# Altium project InterfaceA.PrjPcb
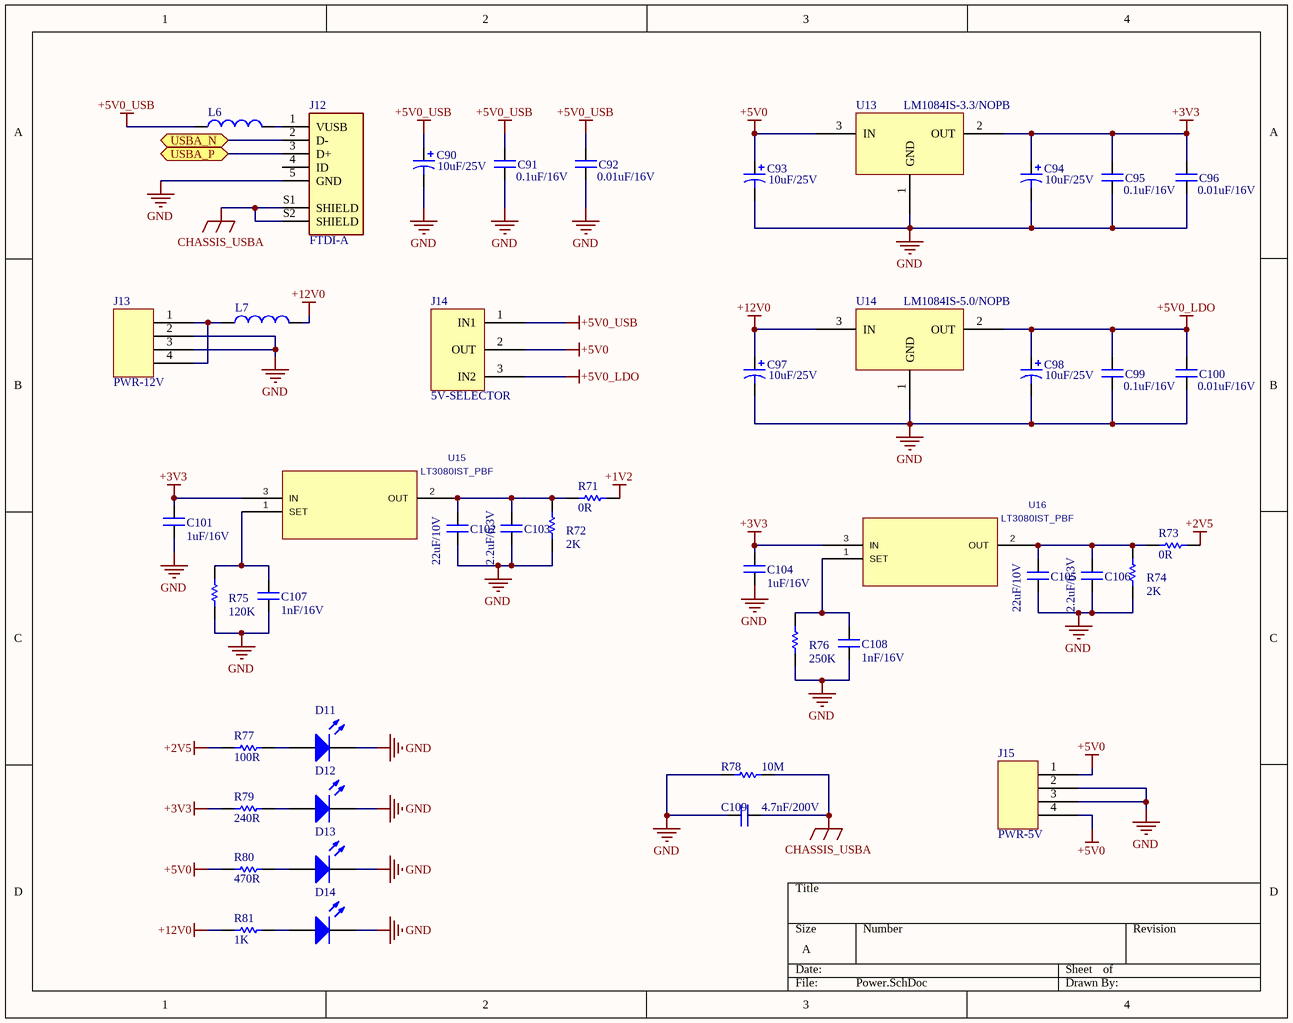
[diagram p0: Power.SchDoc]
9 sheets, 256 parts. Net scope: flat (ports and power ports of the same name join across sheets).
Board file: PCB1.PcbDoc
Sheets:
  Power.SchDoc
  InterfacesA_FPGA.SchDoc
  InterfacesA_Decoupling.SchDoc
  InterfacesA_RGMII_Ethernet.SchDoc
  InterfacesA_SWITCH_LEDS.SchDoc
  InterfacesA_TRANSCEIVER.SchDoc
  InterfacesA_USBFTDI.SchDoc
  InterfacesA_Xbee_Transceiver.SchDoc
  InterfacesA_CONNECTORS.SchDoc

## Sheet Power.SchDoc
size A; DocumentNumber: 1; SheetNumber: 1

### Parts
C90  value 10uF/25V  [CASE-C]  (hidden comment: CASE-C)
C91  value 0.1uF/16V  [CAP_0805]  (hidden comment: CAP_0805)
C92  value 0.01uF/16V  [CAP_0805]  (hidden comment: CAP_0805)
C93  value 10uF/25V  [CASE-C]  (hidden comment: CASE-C)
C94  value 10uF/25V  [CASE-C]  (hidden comment: CASE-C)
C95  value 0.1uF/16V  [CAP_0805]  (hidden comment: CAP_0805)
C96  value 0.01uF/16V  [CAP_0805]  (hidden comment: CAP_0805)
C97  value 10uF/25V  [CASE-C]  (hidden comment: CASE-C)
C98  value 10uF/25V  [CASE-C]  (hidden comment: CASE-C)
C99  value 0.1uF/16V  [CAP_0805]  (hidden comment: CAP_0805)
C100  value 0.01uF/16V  [CAP_0805]  (hidden comment: CAP_0805)
C101  value 1uF/16V  [CAP_0805]  (hidden comment: CAP_0805)
C102  value 22uF/10V  [CAP_0805]  (hidden comment: CAP_0805)
C103  value 2.2uF/6.3V  [CAP_0805]  (hidden comment: CAP_0805)
C104  value 1uF/16V  [CAP_0805]  (hidden comment: CAP_0805)
C105  value 22uF/10V  [CAP_0805]  (hidden comment: CAP_0805)
C106  value 2.2uF/6.3V  [CAP_0805]  (hidden comment: CAP_0805)
C107  value 1nF/16V  [CAP_0805]  (hidden comment: CAP_0805)
C108  value 1nF/16V  [CAP_0805]  (hidden comment: CAP_0805)
C109  value 4.7nF/200V  [CAP_0805]  (hidden comment: CAP_0805)
D11  LED_0603  [LED_0603]  (value not drawn)
D12  LED_0603  [LED_0603]  (value not drawn)
D13  LED_0603  [LED_0603]  (value not drawn)
D14  LED_0603  [LED_0603]  (value not drawn)
J12  FTDI-A  [UX60-MB-5S8]
J13  PWR-12V  [HEADER_4]
J14  5V-SELECTOR  [JUMPER 3 PIN]
J15  PWR-5V  [HEADER_4]
L6  IND_0805  [IND_0805]  (value not drawn)
L7  IND_0805  [IND_0805]  (value not drawn)
R71  value 0R  [RES_0805]  (hidden comment: RES_0805)
R72  value 2K  [RES_0805]  (hidden comment: RES_0805)
R73  value 0R  [RES_0805]  (hidden comment: RES_0805)
R74  value 2K  [RES_0805]  (hidden comment: RES_0805)
R75  value 120K  [RES_0805]  (hidden comment: RES_0805)
R76  value 250K  [RES_0805]  (hidden comment: RES_0805)
R77  value 100R  [RES_0805]  (hidden comment: RES_0805)
R78  value 10M  [RES_0805]  (hidden comment: RES_0805)
R79  value 240R  [RES_0805]  (hidden comment: RES_0805)
R80  value 470R  [RES_0805]  (hidden comment: RES_0805)
R81  value 1K  [RES_0805]  (hidden comment: RES_0805)
U13  LM1084IS-3.3/NOPB  [LM1084IS-3.3/NOPB]
U14  LM1084IS-5.0/NOPB  [LM1084IS-5.0/NOPB]
U15  LT3080IST_PBF  [LT3080IST_PBF]
U16  LT3080IST_PBF  [LT3080IST_PBF]

### Ports
USBA_N (bidir), USBA_P (bidir)

### Nets
+1V2: R71.1
+2V5: R73.1 R77.1
+3V3: C94.A C95.2 C96.2 C101.2 C104.2 R79.1 U13.2(OUT) U15.3(IN) U16.3(IN)
+5V0: C93.A J14.2(OUT) J15.1 J15.4 R80.1 U13.3(IN)
+5V0_LDO: C98.A C99.2 C100.2 J14.3(IN2) U14.2(OUT)
+5V0_USB: C90.A C91.2 C92.2 J14.1(IN1) L6.1
+12V0: C97.A L7.2 R81.1 U14.3(IN)
CHASSIS_USBA: C109.1 J12.S1(SHIELD) J12.S2(SHIELD) R78.1
GND: C90.K C91.1 C92.1 C93.K C94.K C95.1 C96.1 C97.K C98.K C99.1 C100.1 C101.1 C102.1 C103.1 C104.1 C105.1 C106.1 C107.1 C108.1 C109.2 D11.2(K) D12.2(K) D13.2(K) D14.2(K) J12.5(GND) J13.2 J13.3 J15.2 J15.3 R72.1 R74.1 R75.1 R76.1 R78.2 U13.1(GND) U14.1(GND)
USBA_N: J12.2(D-) ; port USBA_N
USBA_P: J12.3(D+) ; port USBA_P
NetC102_2: C102.2 C103.2 R71.2 R72.2 U15.2(OUT)
NetC105_2: C105.2 C106.2 R73.2 R74.2 U16.2(OUT)
NetC107_2: C107.2 R75.2 U15.1(SET)
NetC108_2: C108.2 R76.2 U16.1(SET)
NetD11_1: D11.1(A) R77.2
NetD12_1: D12.1(A) R79.2
NetD13_1: D13.1(A) R80.2
NetD14_1: D14.1(A) R81.2
NetJ12_1: J12.1(VUSB) L6.2
NetJ13_1: J13.1 J13.4 L7.1

Not connected (* = marked no-connect by the designer): J12 4(ID)

### Library data of the parts
J12 = UX60-MB-5S8: USB MINI TYPE B
J13 J15 = HEADER_4
J14 = JUMPER 3 PIN
U15 U16 = LT3080IST_PBF: Manufacturer_Part_Number: LT3080IST#PBF; Vendor: Linear Technology; SourceLibrary: LinearTech_2016-05-13_3; Built_By: EMA_UL_Team; Value: LT3080IST_PBF
U13 = LM1084IS-3.3/NOPB: Supplier 1: Digi-Key; Supplier Part Number 1: 296-35390-1-ND
U14 = LM1084IS-5.0/NOPB: Supplier 1: Digi-Key; Supplier Part Number 1: 296-35390-1-ND

## Sheet InterfacesA_FPGA.SchDoc
size A; DocumentNumber: 2; SheetNumber: 2
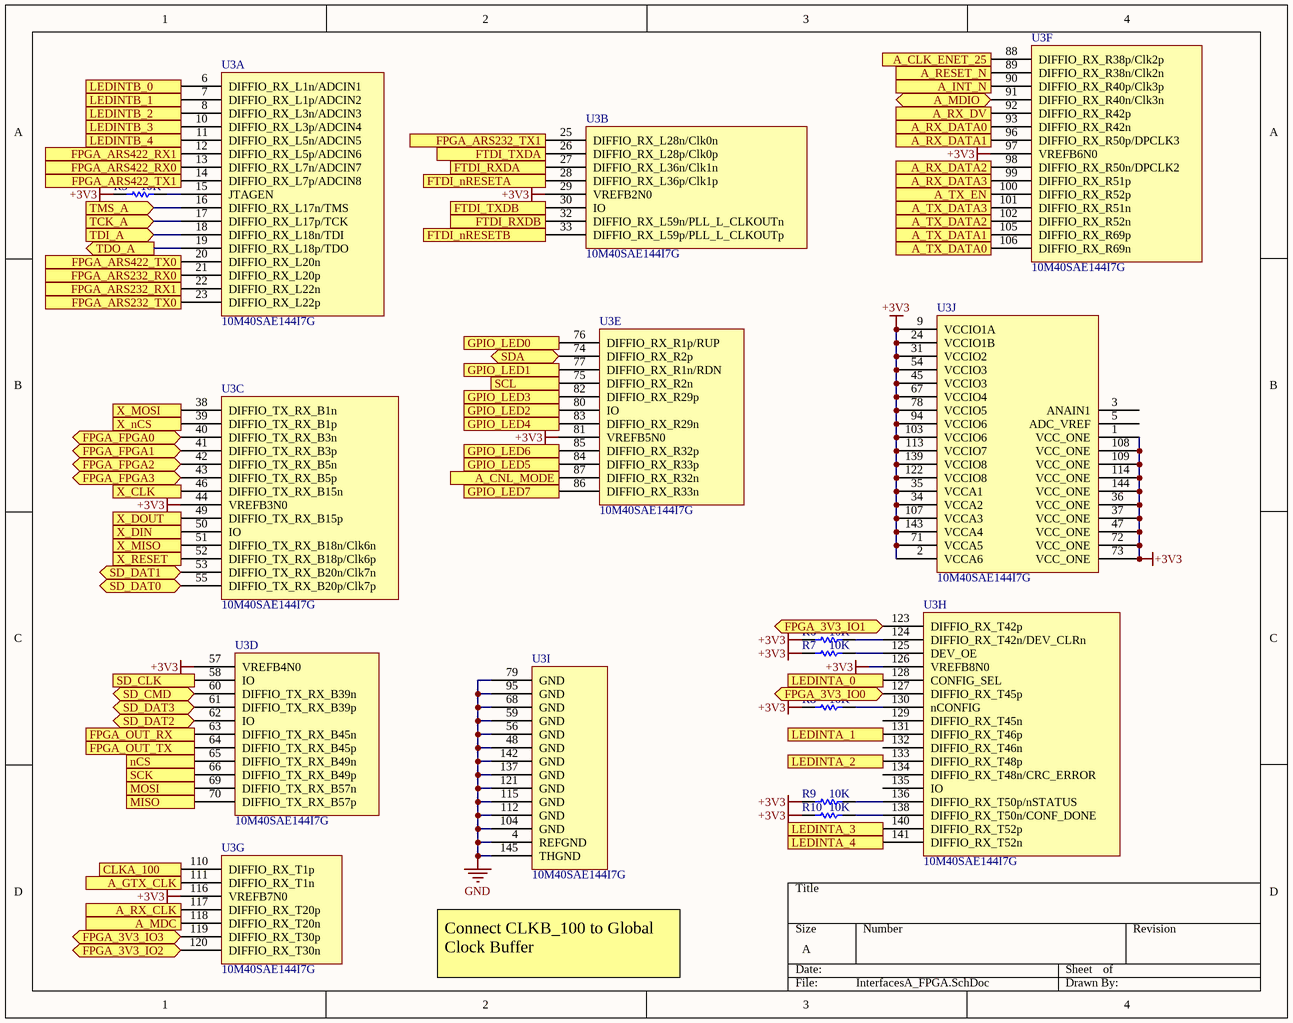
[diagram p1: InterfacesA_FPGA.SchDoc]

### Parts
R5  value 10K  [RES_0805]  (hidden comment: RES_0805)
R6  value 10K  [RES_0805]  (hidden comment: RES_0805)
R7  value 10K  [RES_0805]  (hidden comment: RES_0805)
R8  value 10K  [RES_0805]  (hidden comment: RES_0805)
R9  value 10K  [RES_0805]  (hidden comment: RES_0805)
R10  value 10K  [RES_0805]  (hidden comment: RES_0805)
U3  10M40SAE144I7G  [10M40SAE144I7G]  (parts A,B,C,D,E,F,G,H,I,J of 10)

### Ports
A_CLK_ENET_25 (out), A_CNL_MODE (in), A_GTX_CLK (out), A_INT_N (in), A_MDC (out), A_MDIO (bidir), A_RESET_N (out), A_RX_CLK (out), A_RX_DATA0 (in), A_RX_DATA1 (in), A_RX_DATA2 (in), A_RX_DATA3 (in), A_RX_DV (in), A_TX_DATA0 (out), A_TX_DATA1 (out), A_TX_DATA2 (out), A_TX_DATA3 (out), A_TX_EN (out), CLKA_100 (out), FPGA_3V3_IO0 (bidir), FPGA_3V3_IO1 (bidir), FPGA_3V3_IO2 (bidir), FPGA_3V3_IO3 (bidir), FPGA_ARS232_RX0 (in), FPGA_ARS232_RX1 (in), FPGA_ARS232_TX0 (out), FPGA_ARS232_TX1 (out), FPGA_ARS422_RX0 (in), FPGA_ARS422_RX1 (in), FPGA_ARS422_TX0 (out), FPGA_ARS422_TX1 (out), FPGA_FPGA0 (bidir), FPGA_FPGA1 (bidir), FPGA_FPGA2 (bidir), FPGA_FPGA3 (bidir), FPGA_OUT_RX (in), FPGA_OUT_TX (out), FTDI_nRESETA (out), FTDI_nRESETB (out), FTDI_RXDA (in), FTDI_RXDB (in), FTDI_TXDA (out), FTDI_TXDB (out), GPIO_LED0 (out), GPIO_LED1 (out), GPIO_LED2 (out), GPIO_LED3 (out), GPIO_LED4 (out), GPIO_LED5 (out), GPIO_LED6 (out), GPIO_LED7 (out), LEDINTA_0 (out), LEDINTA_1 (out), LEDINTA_2 (out), LEDINTA_3 (out), LEDINTA_4 (out), LEDINTB_0 (out), LEDINTB_1 (out), LEDINTB_2 (out), LEDINTB_3 (out), LEDINTB_4 (out), MISO (in), MOSI (out), nCS (out), SCK (out), SCL (out), SD_CLK (out), SD_CMD (bidir), SD_DAT0 (bidir), SD_DAT1 (bidir), SD_DAT2 (bidir), SD_DAT3 (bidir), SDA (bidir), TCK_A (in), TDI_A (in), TDO_A (out), TMS_A (in), X_CLK (out), X_DIN (out), X_DOUT (in), X_MISO (in), X_MOSI (out), X_nCS (out), X_RESET (out)

### Nets
+3V3: R5.2 R6.2 R7.2 R8.2 R9.2 R10.2 U3.1(VCC_ONE) U3.2(VCCA6) U3.9(VCCIO1A) U3.24(VCCIO1B) U3.29(VREFB2N0) U3.31(VCCIO2) U3.34(VCCA2) U3.35(VCCA1) U3.36(VCC_ONE) U3.37(VCC_ONE) U3.44(VREFB3N0) U3.45(VCCIO3) U3.47(VCC_ONE) U3.54(VCCIO3) U3.57(VREFB4N0) U3.67(VCCIO4) U3.71(VCCA5) U3.72(VCC_ONE) U3.73(VCC_ONE) U3.78(VCCIO5) U3.81(VREFB5N0) U3.94(VCCIO6) U3.97(VREFB6N0) U3.103(VCCIO6) U3.107(VCCA3) U3.108(VCC_ONE) U3.109(VCC_ONE) U3.113(VCCIO7) U3.114(VCC_ONE) U3.116(VREFB7N0) U3.122(VCCIO8) U3.126(VREFB8N0) U3.139(VCCIO8) U3.143(VCCA4) U3.144(VCC_ONE)
GND: U3.4(REFGND) U3.48(GND) U3.56(GND) U3.59(GND) U3.68(GND) U3.79(GND) U3.95(GND) U3.104(GND) U3.112(GND) U3.115(GND) U3.121(GND) U3.137(GND) U3.142(GND) U3.145(THGND)
CLK: U3.58(IO) ; port SD_CLK
CLK_ENET_25: U3.88(DIFFIO_RX_R38p/Clk2p) ; port A_CLK_ENET_25
CLKA_100: U3.110(DIFFIO_RX_T1p) ; port CLKA_100
CMD: U3.60(DIFFIO_TX_RX_B39n) ; port SD_CMD
CNL_MODE: U3.87(DIFFIO_RX_R32n) ; port A_CNL_MODE
DAT0: U3.55(DIFFIO_TX_RX_B20p/Clk7p) ; port SD_DAT0
DAT1: U3.53(DIFFIO_TX_RX_B20n/Clk7n) ; port SD_DAT1
DAT2: U3.62(IO) ; port SD_DAT2
DAT3: U3.61(DIFFIO_TX_RX_B39p) ; port SD_DAT3
FPGA_3V3_IO0: U3.127(DIFFIO_RX_T45p) ; port FPGA_3V3_IO0
FPGA_3V3_IO1: U3.123(DIFFIO_RX_T42p) ; port FPGA_3V3_IO1
FPGA_3V3_IO2: U3.120(DIFFIO_RX_T30n) ; port FPGA_3V3_IO2
FPGA_3V3_IO3: U3.119(DIFFIO_RX_T30p) ; port FPGA_3V3_IO3
FPGA_ARS232_RX0: U3.21(DIFFIO_RX_L20p) ; port FPGA_ARS232_RX0
FPGA_ARS232_RX1: U3.22(DIFFIO_RX_L22n) ; port FPGA_ARS232_RX1
FPGA_ARS232_TX0: U3.23(DIFFIO_RX_L22p) ; port FPGA_ARS232_TX0
FPGA_ARS232_TX1: U3.25(DIFFIO_RX_L28n/Clk0n) ; port FPGA_ARS232_TX1
FPGA_ARS422_RX0: U3.13(DIFFIO_RX_L7n/ADCIN7) ; port FPGA_ARS422_RX0
FPGA_ARS422_RX1: U3.12(DIFFIO_RX_L5p/ADCIN6) ; port FPGA_ARS422_RX1
FPGA_ARS422_TX0: U3.20(DIFFIO_RX_L20n) ; port FPGA_ARS422_TX0
FPGA_ARS422_TX1: U3.14(DIFFIO_RX_L7p/ADCIN8) ; port FPGA_ARS422_TX1
FPGA_FPGA0: U3.40(DIFFIO_TX_RX_B3n) ; port FPGA_FPGA0
FPGA_FPGA1: U3.41(DIFFIO_TX_RX_B3p) ; port FPGA_FPGA1
FPGA_FPGA2: U3.42(DIFFIO_TX_RX_B5n) ; port FPGA_FPGA2
FPGA_FPGA3: U3.43(DIFFIO_TX_RX_B5p) ; port FPGA_FPGA3
FPGA_OUT_RX: U3.63(DIFFIO_TX_RX_B45n) ; port FPGA_OUT_RX
FPGA_OUT_TX: U3.64(DIFFIO_TX_RX_B45p) ; port FPGA_OUT_TX
FTDI_RXDA: U3.27(DIFFIO_RX_L36n/Clk1n) ; port FTDI_RXDA
FTDI_RXDB: U3.32(DIFFIO_RX_L59n/PLL_L_CLKOUTn) ; port FTDI_RXDB
FTDI_TXDA: U3.26(DIFFIO_RX_L28p/Clk0p) ; port FTDI_TXDA
FTDI_TXDB: U3.30(IO) ; port FTDI_TXDB
GPIO_LED0: U3.76(DIFFIO_RX_R1p/RUP) ; port GPIO_LED0
GPIO_LED1: U3.77(DIFFIO_RX_R1n/RDN) ; port GPIO_LED1
GPIO_LED2: U3.80(IO) ; port GPIO_LED2
GPIO_LED3: U3.82(DIFFIO_RX_R29p) ; port GPIO_LED3
GPIO_LED4: U3.83(DIFFIO_RX_R29n) ; port GPIO_LED4
GPIO_LED5: U3.84(DIFFIO_RX_R33p) ; port GPIO_LED5
GPIO_LED6: U3.85(DIFFIO_RX_R32p) ; port GPIO_LED6
GPIO_LED7: U3.86(DIFFIO_RX_R33n) ; port GPIO_LED7
GTX_CLK: U3.111(DIFFIO_RX_T1n) ; port A_GTX_CLK
INT_N: U3.90(DIFFIO_RX_R40p/Clk3p) ; port A_INT_N
LEDINTA_0: U3.128(CONFIG_SEL) ; port LEDINTA_0
LEDINTA_1: U3.131(DIFFIO_RX_T46p) ; port LEDINTA_1
LEDINTA_2: U3.133(DIFFIO_RX_T48p) ; port LEDINTA_2
LEDINTA_3: U3.140(DIFFIO_RX_T52p) ; port LEDINTA_3
LEDINTA_4: U3.141(DIFFIO_RX_T52n) ; port LEDINTA_4
LEDINTB_0: U3.6(DIFFIO_RX_L1n/ADCIN1) ; port LEDINTB_0
LEDINTB_1: U3.7(DIFFIO_RX_L1p/ADCIN2) ; port LEDINTB_1
LEDINTB_2: U3.8(DIFFIO_RX_L3n/ADCIN3) ; port LEDINTB_2
LEDINTB_3: U3.10(DIFFIO_RX_L3p/ADCIN4) ; port LEDINTB_3
LEDINTB_4: U3.11(DIFFIO_RX_L5n/ADCIN5) ; port LEDINTB_4
MDC: U3.118(DIFFIO_RX_T20n) ; port A_MDC
MDIO: U3.91(DIFFIO_RX_R40n/Clk3n) ; port A_MDIO
MISO: U3.70(DIFFIO_TX_RX_B57p) ; port MISO
MOSI: U3.69(DIFFIO_TX_RX_B57n) ; port MOSI
nCS: U3.65(DIFFIO_TX_RX_B49n) ; port nCS
nRST: U3.52(DIFFIO_TX_RX_B18p/Clk6p) ; port X_RESET
RESET_N: U3.89(DIFFIO_RX_R38n/Clk2n) ; port A_RESET_N
RST_A: U3.28(DIFFIO_RX_L36p/Clk1p) ; port FTDI_nRESETA
RST_B: U3.33(DIFFIO_RX_L59p/PLL_L_CLKOUTp) ; port FTDI_nRESETB
RX_CLK: U3.117(DIFFIO_RX_T20p) ; port A_RX_CLK
RX_DATA0: U3.93(DIFFIO_RX_R42n) ; port A_RX_DATA0
RX_DATA1: U3.96(DIFFIO_RX_R50p/DPCLK3) ; port A_RX_DATA1
RX_DATA2: U3.98(DIFFIO_RX_R50n/DPCLK2) ; port A_RX_DATA2
RX_DATA3: U3.99(DIFFIO_RX_R51p) ; port A_RX_DATA3
RX_DV: U3.92(DIFFIO_RX_R42p) ; port A_RX_DV
SCK: U3.66(DIFFIO_TX_RX_B49p) ; port SCK
SCL: U3.75(DIFFIO_RX_R2n) ; port SCL
SDA: U3.74(DIFFIO_RX_R2p) ; port SDA
TCK_A: U3.17(DIFFIO_RX_L17p/TCK) ; port TCK_A
TDI_A: U3.18(DIFFIO_RX_L18n/TDI) ; port TDI_A
TDO_A: U3.19(DIFFIO_RX_L18p/TDO) ; port TDO_A
TMS_A: U3.16(DIFFIO_RX_L17n/TMS) ; port TMS_A
TX_DATA0: U3.106(DIFFIO_RX_R69n) ; port A_TX_DATA0
TX_DATA1: U3.105(DIFFIO_RX_R69p) ; port A_TX_DATA1
TX_DATA2: U3.102(DIFFIO_RX_R52n) ; port A_TX_DATA2
TX_DATA3: U3.101(DIFFIO_RX_R51n) ; port A_TX_DATA3
TX_EN: U3.100(DIFFIO_RX_R52p) ; port A_TX_EN
X_CLK: U3.46(DIFFIO_TX_RX_B15n) ; port X_CLK
X_DIN: U3.50(IO) ; port X_DIN
X_DOUT: U3.49(DIFFIO_TX_RX_B15p) ; port X_DOUT
X_MISO: U3.51(DIFFIO_TX_RX_B18n/Clk6n) ; port X_MISO
X_MOSI: U3.38(DIFFIO_TX_RX_B1n) ; port X_MOSI
X_nCS: U3.39(DIFFIO_TX_RX_B1p) ; port X_nCS
NetR5_1: R5.1 U3.15(JTAGEN)
NetR6_1: R6.1 U3.124(DIFFIO_RX_T42n/DEV_CLRn)
NetR7_1: R7.1 U3.125(DEV_OE)
NetR8_1: R8.1 U3.130(nCONFIG)
NetR9_1: R9.1 U3.136(DIFFIO_RX_T50p/nSTATUS)
NetR10_1: R10.1 U3.138(DIFFIO_RX_T50n/CONF_DONE)

Not connected (* = marked no-connect by the designer): U3 3(ANAIN1) 5(ADC_VREF) 129(DIFFIO_RX_T45n) 132(DIFFIO_RX_T46n) 134(DIFFIO_RX_T48n/CRC_ERROR) 135(IO)

### Notes on the sheet
- Connect CLKB_100 to Global Clock Buffer

### Library data of the parts
U3 = 10M40SAE144I7G: IC FPGA 101 I/O 144EQFP

## Sheet InterfacesA_Decoupling.SchDoc
size A; DocumentNumber: 3; SheetNumber: 3
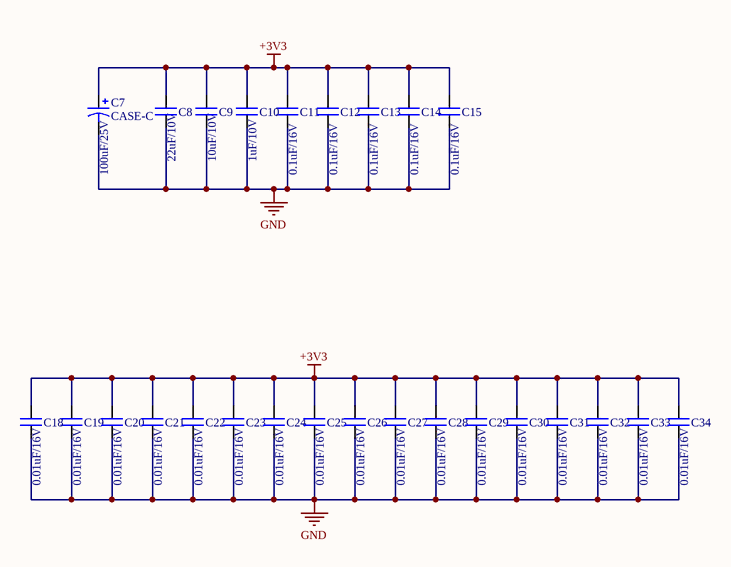
[diagram p2: InterfacesA_Decoupling.SchDoc]

### Parts
C7  CASE-C  value 100uF/25V  [CASE-C]
C8  value 22uF/10V  [CAP_0805]  (hidden comment: CAP_0805)
C9  value 10uF/10V  [CAP_0805]  (hidden comment: CAP_0805)
C10  value 1uF/10V  [CAP_0805]  (hidden comment: CAP_0805)
C11  value 0.1uF/16V  [CAP_0805]  (hidden comment: CAP_0805)
C12  value 0.1uF/16V  [CAP_0805]  (hidden comment: CAP_0805)
C13  value 0.1uF/16V  [CAP_0805]  (hidden comment: CAP_0805)
C14  value 0.1uF/16V  [CAP_0805]  (hidden comment: CAP_0805)
C15  value 0.1uF/16V  [CAP_0805]  (hidden comment: CAP_0805)
C18  value 0.01uF/16V  [CAP_0805]  (hidden comment: CAP_0805)
C19  value 0.01uF/16V  [CAP_0805]  (hidden comment: CAP_0805)
C20  value 0.01uF/16V  [CAP_0805]  (hidden comment: CAP_0805)
C21  value 0.01uF/16V  [CAP_0805]  (hidden comment: CAP_0805)
C22  value 0.01uF/16V  [CAP_0805]  (hidden comment: CAP_0805)
C23  value 0.01uF/16V  [CAP_0805]  (hidden comment: CAP_0805)
C24  value 0.01uF/16V  [CAP_0805]  (hidden comment: CAP_0805)
C25  value 0.01uF/16V  [CAP_0805]  (hidden comment: CAP_0805)
C26  value 0.01uF/16V  [CAP_0805]  (hidden comment: CAP_0805)
C27  value 0.01uF/16V  [CAP_0805]  (hidden comment: CAP_0805)
C28  value 0.01uF/16V  [CAP_0805]  (hidden comment: CAP_0805)
C29  value 0.01uF/16V  [CAP_0805]  (hidden comment: CAP_0805)
C30  value 0.01uF/16V  [CAP_0805]  (hidden comment: CAP_0805)
C31  value 0.01uF/16V  [CAP_0805]  (hidden comment: CAP_0805)
C32  value 0.01uF/16V  [CAP_0805]  (hidden comment: CAP_0805)
C33  value 0.01uF/16V  [CAP_0805]  (hidden comment: CAP_0805)
C34  value 0.01uF/16V  [CAP_0805]  (hidden comment: CAP_0805)

### Nets
+3V3: C7.A C8.2 C9.2 C10.2 C11.2 C12.2 C13.2 C14.2 C15.2 C18.2 C19.2 C20.2 C21.2 C22.2 C23.2 C24.2 C25.2 C26.2 C27.2 C28.2 C29.2 C30.2 C31.2 C32.2 C33.2 C34.2
GND: C7.K C8.1 C9.1 C10.1 C11.1 C12.1 C13.1 C14.1 C15.1 C18.1 C19.1 C20.1 C21.1 C22.1 C23.1 C24.1 C25.1 C26.1 C27.1 C28.1 C29.1 C30.1 C31.1 C32.1 C33.1 C34.1

## Sheet InterfacesA_RGMII_Ethernet.SchDoc
size A4; DocumentNumber: 8; SheetNumber: 8
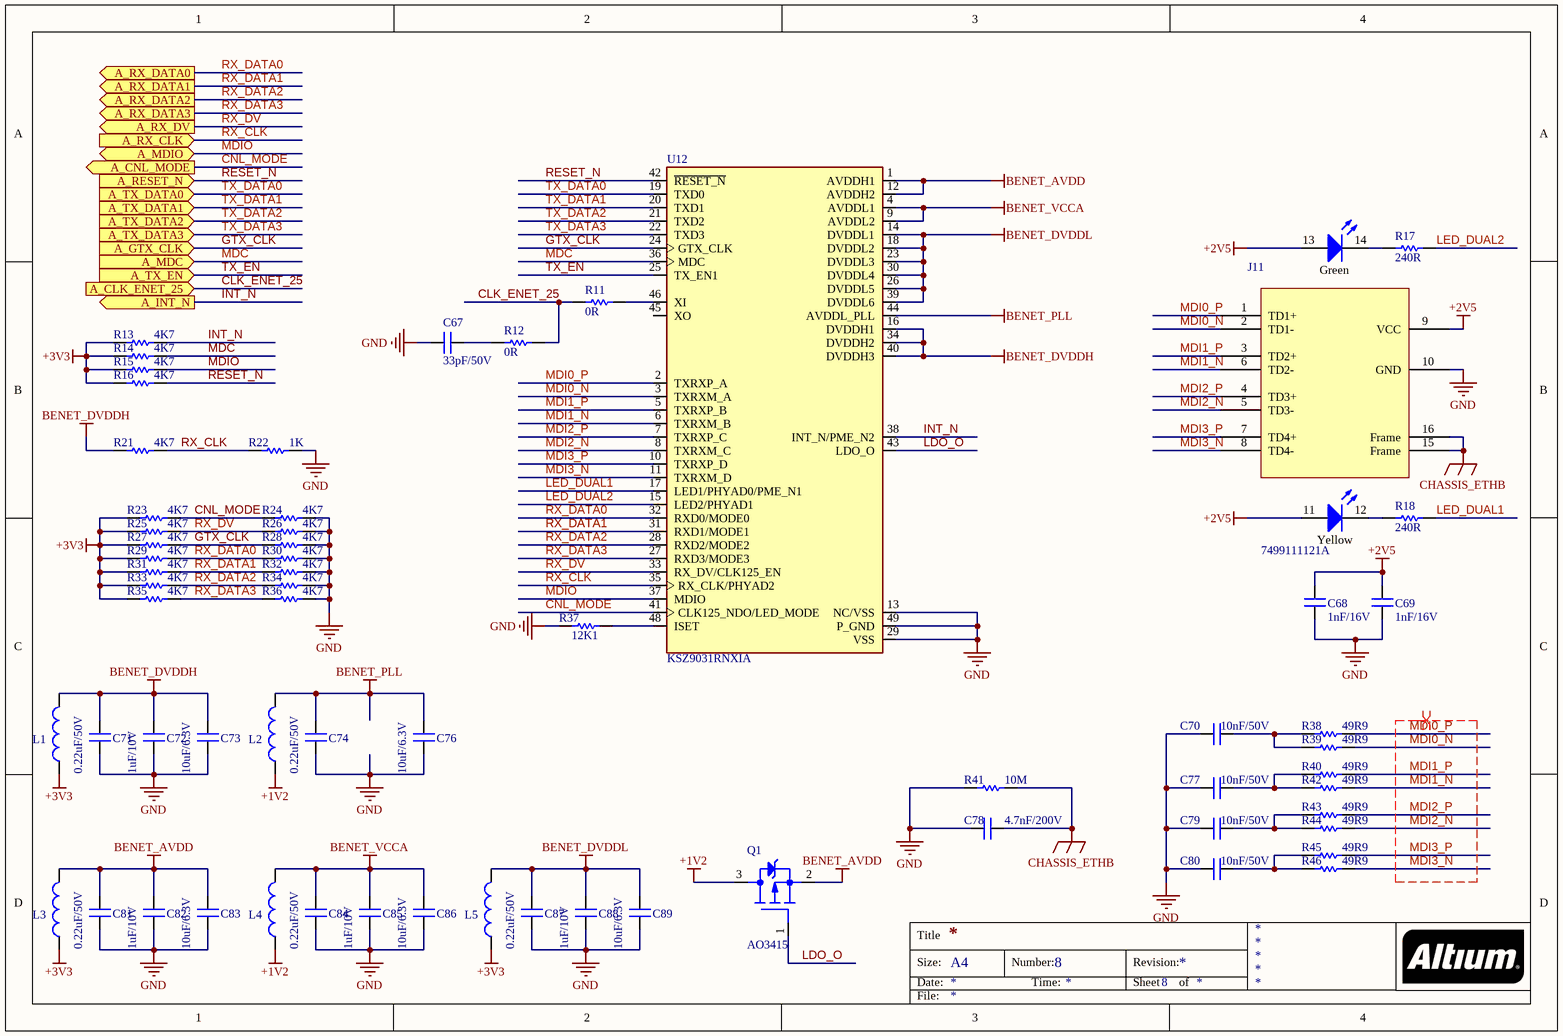
[diagram p3: InterfacesA_RGMII_Ethernet.SchDoc]

### Parts
C67  value 33pF/50V  [CAP_0805]  (hidden comment: CAP_0805)
C68  value 1nF/16V  [CAP_0805]  (hidden comment: CAP_0805)
C69  value 1nF/16V  [CAP_0805]  (hidden comment: CAP_0805)
C70  value 10nF/50V  [CAP_0805]  (hidden comment: CAP_0805)
C71  value 0.22uF/50V  [CAP_0805]  (hidden comment: CAP_0805)
C72  value 1uF/10V  [CAP_0805]  (hidden comment: CAP_0805)
C73  value 10uF/6.3V  [CAP_0805]  (hidden comment: CAP_0805)
C74  value 0.22uF/50V  [CAP_0805]  (hidden comment: CAP_0805)
C76  value 10uF/6.3V  [CAP_0805]  (hidden comment: CAP_0805)
C77  value 10nF/50V  [CAP_0805]  (hidden comment: CAP_0805)
C78  value 4.7nF/200V  [CAP_0805]  (hidden comment: CAP_0805)
C79  value 10nF/50V  [CAP_0805]  (hidden comment: CAP_0805)
C80  value 10nF/50V  [CAP_0805]  (hidden comment: CAP_0805)
C81  value 0.22uF/50V  [CAP_0805]  (hidden comment: CAP_0805)
C82  value 1uF/10V  [CAP_0805]  (hidden comment: CAP_0805)
C83  value 10uF/6.3V  [CAP_0805]  (hidden comment: CAP_0805)
C84  value 0.22uF/50V  [CAP_0805]  (hidden comment: CAP_0805)
C85  value 1uF/10V  [CAP_0805]  (hidden comment: CAP_0805)
C86  value 10uF/6.3V  [CAP_0805]  (hidden comment: CAP_0805)
C87  value 0.22uF/50V  [CAP_0805]  (hidden comment: CAP_0805)
C88  value 1uF/10V  [CAP_0805]  (hidden comment: CAP_0805)
C89  value 10uF/6.3V  [CAP_0805]  (hidden comment: CAP_0805)
J11  7499111121A  [7499111121A]
L1  IND_0805  [IND_0805]  (value not drawn)
L2  IND_0805  [IND_0805]  (value not drawn)
L3  IND_0805  [IND_0805]  (value not drawn)
L4  IND_0805  [IND_0805]  (value not drawn)
L5  IND_0805  [IND_0805]  (value not drawn)
Q1  AO3415  [AO3415]
R11  value 0R  [RES_0805]  (hidden comment: RES_0805)
R12  value 0R  [RES_0805]  (hidden comment: RES_0805)
R13  value 4K7  [RES_0805]  (hidden comment: RES_0805)
R14  value 4K7  [RES_0805]  (hidden comment: RES_0805)
R15  value 4K7  [RES_0805]  (hidden comment: RES_0805)
R16  value 4K7  [RES_0805]  (hidden comment: RES_0805)
R17  value 240R  [RES_0805]  (hidden comment: RES_0805)
R18  value 240R  [RES_0805]  (hidden comment: RES_0805)
R21  value 4K7  [RES_0805]  (hidden comment: RES_0805)
R22  value 1K  [RES_0805]  (hidden comment: RES_0805)
R23  value 4K7  [RES_0805]  (hidden comment: RES_0805)
R24  value 4K7  [RES_0805]  (hidden comment: RES_0805)
R25  value 4K7  [RES_0805]  (hidden comment: RES_0805)
R26  value 4K7  [RES_0805]  (hidden comment: RES_0805)
R27  value 4K7  [RES_0805]  (hidden comment: RES_0805)
R28  value 4K7  [RES_0805]  (hidden comment: RES_0805)
R29  value 4K7  [RES_0805]  (hidden comment: RES_0805)
R30  value 4K7  [RES_0805]  (hidden comment: RES_0805)
R31  value 4K7  [RES_0805]  (hidden comment: RES_0805)
R32  value 4K7  [RES_0805]  (hidden comment: RES_0805)
R33  value 4K7  [RES_0805]  (hidden comment: RES_0805)
R34  value 4K7  [RES_0805]  (hidden comment: RES_0805)
R35  value 4K7  [RES_0805]  (hidden comment: RES_0805)
R36  value 4K7  [RES_0805]  (hidden comment: RES_0805)
R37  value 12K1  [RES_0805]  (hidden comment: RES_0805)
R38  value 49R9  [RES_0805]  (hidden comment: RES_0805)
R39  value 49R9  [RES_0805]  (hidden comment: RES_0805)
R40  value 49R9  [RES_0805]  (hidden comment: RES_0805)
R41  value 10M  [RES_0805]  (hidden comment: RES_0805)
R42  value 49R9  [RES_0805]  (hidden comment: RES_0805)
R43  value 49R9  [RES_0805]  (hidden comment: RES_0805)
R44  value 49R9  [RES_0805]  (hidden comment: RES_0805)
R45  value 49R9  [RES_0805]  (hidden comment: RES_0805)
R46  value 49R9  [RES_0805]  (hidden comment: RES_0805)
U12  KSZ9031RNXIA  [KSZ9031RNXIA]

### Ports
A_CLK_ENET_25 (in), A_CNL_MODE (out), A_GTX_CLK (in), A_INT_N (out), A_MDC (in), A_MDIO (bidir), A_RESET_N (in), A_RX_CLK (in), A_RX_DATA0 (out), A_RX_DATA1 (out), A_RX_DATA2 (out), A_RX_DATA3 (out), A_RX_DV (out), A_TX_DATA0 (in), A_TX_DATA1 (in), A_TX_DATA2 (in), A_TX_DATA3 (in), A_TX_EN (in)

### Nets
+1V2: L2.1 L4.1 Q1.3(D)
+2V5: C68.2 C69.2 J11.9(VCC) J11.11(A) J11.13(A)
+3V3: L1.1 L3.1 L5.1 R13.2 R14.2 R15.2 R16.2 R23.2 R25.2 R27.2 R29.2 R31.2 R33.2 R35.2
BENET_AVDD: C81.2 C82.2 C83.2 L3.2 Q1.2(S) U12.1(AVDDH1) U12.12(AVDDH2)
BENET_DVDDH: C71.2 C72.2 C73.2 L1.2 R21.2 U12.16(DVDDH1) U12.34(DVDDH2) U12.40(DVDDH3)
BENET_DVDDL: C87.2 C88.2 C89.2 L5.2 U12.14(DVDDL1) U12.18(DVDDL2) U12.23(DVDDL3) U12.26(DVDDL5) U12.30(DVDDL4) U12.39(DVDDL6)
BENET_PLL: C74.2 C76.2 L2.2 U12.44(AVDDL_PLL)
BENET_VCCA: C84.2 C85.2 C86.2 L4.2 U12.4(AVDDL1) U12.9(AVDDL2)
CHASSIS_ETHB: C78.1 J11.15(Frame) J11.16(Frame) R41.1
GND: C67.2 C68.1 C69.1 C70.2 C71.1 C72.1 C73.1 C74.1 C76.1 C77.2 C78.2 C79.2 C80.2 C81.1 C82.1 C83.1 C84.1 C85.1 C86.1 C87.1 C88.1 C89.1 J11.10(GND) R22.1 R24.1 R26.1 R28.1 R30.1 R32.1 R34.1 R36.1 R37.1 R41.2 U12.13(NC/VSS) U12.29(VSS) U12.49(P_GND)
CLK_ENET_25: R11.2 R12.2 ; port A_CLK_ENET_25
CNL_MODE: R23.1 R24.2 U12.41(CLK125_NDO/LED_MODE) ; port A_CNL_MODE
GTX_CLK: R27.1 R28.2 U12.24(GTX_CLK) ; port A_GTX_CLK
INT_N: R13.1 U12.38(INT_N/PME_N2) ; port A_INT_N
LDO_O: Q1.1(G) U12.43(LDO_O)
LED_DUAL1: R18.2 U12.17(LED1/PHYAD0/PME_N1)
LED_DUAL2: R17.2 U12.15(LED2/PHYAD1)
MDC: R14.1 U12.36(MDC) ; port A_MDC
MDI0_N: J11.2(TD1-) R39.2 U12.3(TXRXM_A)
MDI0_P: J11.1(TD1+) R38.2 U12.2(TXRXP_A)
MDI1_N: J11.6(TD2-) R42.2 U12.6(TXRXM_B)
MDI1_P: J11.3(TD2+) R40.2 U12.5(TXRXP_B)
MDI2_N: J11.5(TD3-) R44.2 U12.8(TXRXM_C)
MDI2_P: J11.4(TD3+) R43.2 U12.7(TXRXP_C)
MDI3_N: J11.8(TD4-) R46.2 U12.11(TXRXM_D)
MDI3_P: J11.7(TD4+) R45.2 U12.10(TXRXP_D)
MDIO: R15.1 U12.37(MDIO) ; port A_MDIO
RESET_N: R16.1 U12.42(~{RESET_N}) ; port A_RESET_N
RX_CLK: R21.1 R22.2 U12.35(RX_CLK/PHYAD2) ; port A_RX_CLK
RX_DATA0: R29.1 R30.2 U12.32(RXD0/MODE0) ; port A_RX_DATA0
RX_DATA1: R31.1 R32.2 U12.31(RXD1/MODE1) ; port A_RX_DATA1
RX_DATA2: R33.1 R34.2 U12.28(RXD2/MODE2) ; port A_RX_DATA2
RX_DATA3: R35.1 R36.2 U12.27(RXD3/MODE3) ; port A_RX_DATA3
RX_DV: R25.1 R26.2 U12.33(RX_DV/CLK125_EN) ; port A_RX_DV
TX_DATA0: U12.19(TXD0) ; port A_TX_DATA0
TX_DATA1: U12.20(TXD1) ; port A_TX_DATA1
TX_DATA2: U12.21(TXD2) ; port A_TX_DATA2
TX_DATA3: U12.22(TXD3) ; port A_TX_DATA3
TX_EN: U12.25(TX_EN1) ; port A_TX_EN
NetC67_1: C67.1 R12.1
NetC70_1: C70.1 R38.1 R39.1
NetC77_1: C77.1 R40.1 R42.1
NetC79_1: C79.1 R43.1 R44.1
NetC80_1: C80.1 R45.1 R46.1
NetJ11_12: J11.12(K) R18.1
NetJ11_14: J11.14(K) R17.1
NetR11_1: R11.1 U12.46(XI)
NetR37_2: R37.2 U12.48(ISET)

Not connected (* = marked no-connect by the designer): U12 45(XO)

### Layout directives
differential pair: MDI0_N, MDI0_P, MDI1_N, MDI1_P, MDI2_N, MDI2_P, MDI3_N, MDI3_P

### Notes on the sheet
- Title
- Size:
- Date:
- A4
- Number:
- Time:
- Revision:
- Sheet
- of
- File:
- (in symbol 7499111121A) Green; Yellow

### Library data of the parts
Q1 = AO3415: 20V P-Channel MOSFET
U12 = KSZ9031RNXIA: 4/4 Transceiver Full Ethernet 48-QFN _7x7_; MF: Microchip; MP: KSZ9031RNXIA; Digi-Key_Purchase_URL: https://www.digikey.pk/product-detail/en/microchip-technology/KSZ9031RNXIA-TR/KSZ9031RNXIA-TR-ND/3925129?utm_source=snapeda&utm_medium=aggregator&utm_campaign=symbol; Package: QFN-48 Microchip; SnapEDA_Link: https://www.snapeda.com/parts/KSZ9031RNXIA/Microchip/view-part/378526/?ref=snap; Value: *; Digi-Key_Part_Number: KSZ9031RNXIA-TR-ND
J11 = 7499111121A: Supplier 1: Digi-Key; Supplier Part Number 1: 1297-1070-5-ND

## Sheet InterfacesA_SWITCH_LEDS.SchDoc
size A
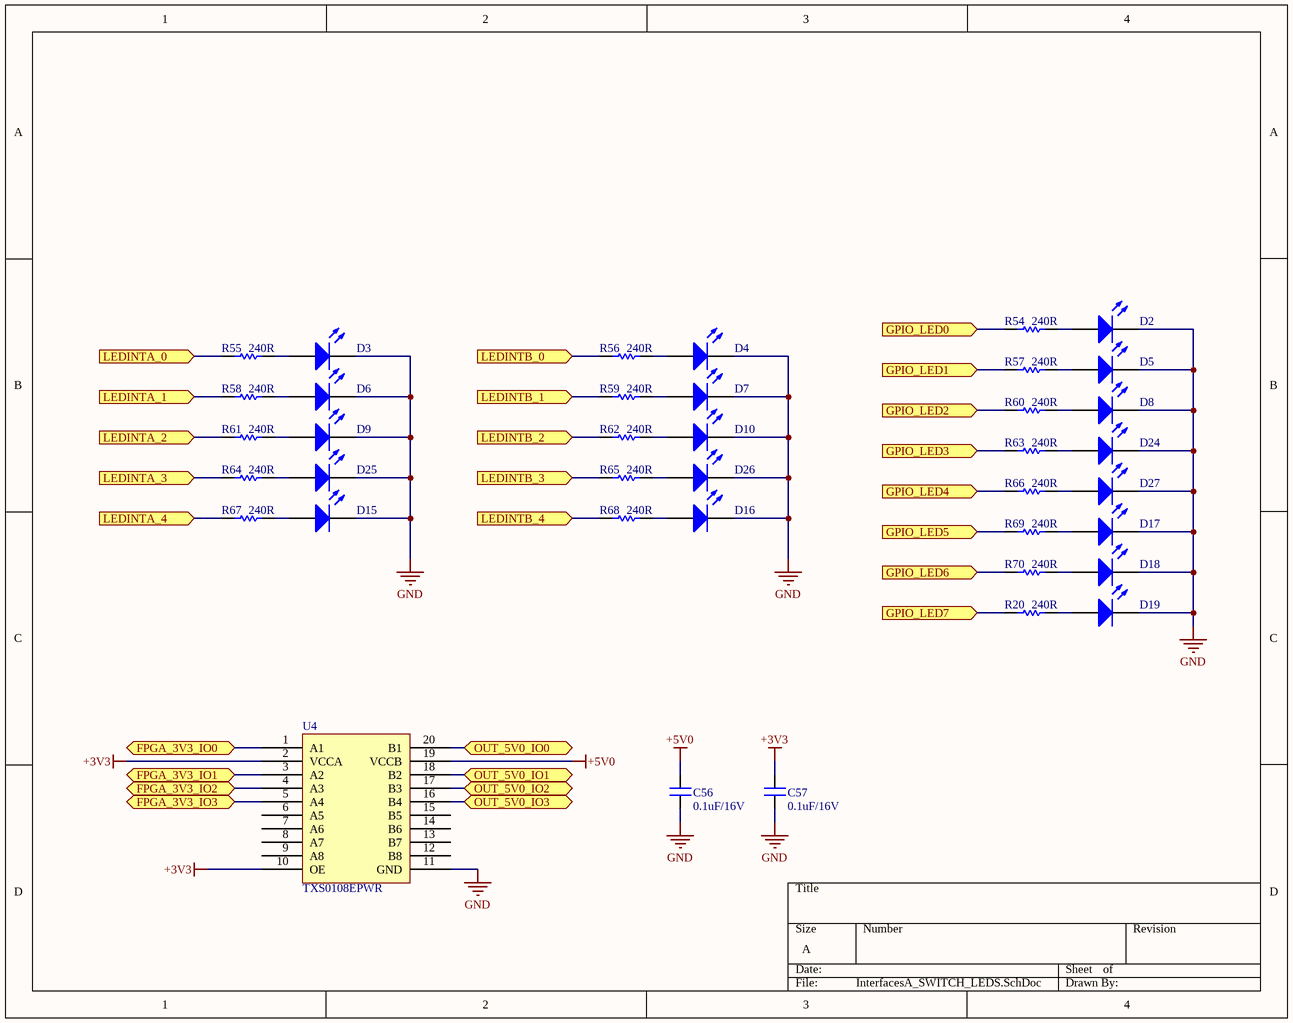
[diagram p4: InterfacesA_SWITCH_LEDS.SchDoc]

### Parts
C56  value 0.1uF/16V  [CAP_0805]  (hidden comment: CAP_0805)
C57  value 0.1uF/16V  [CAP_0805]  (hidden comment: CAP_0805)
D2  LED_0603  [LED_0603]  (value not drawn)
D3  LED_0603  [LED_0603]  (value not drawn)
D4  LED_0603  [LED_0603]  (value not drawn)
D5  LED_0603  [LED_0603]  (value not drawn)
D6  LED_0603  [LED_0603]  (value not drawn)
D7  LED_0603  [LED_0603]  (value not drawn)
D8  LED_0603  [LED_0603]  (value not drawn)
D9  LED_0603  [LED_0603]  (value not drawn)
D10  LED_0603  [LED_0603]  (value not drawn)
D15  LED_0603  [LED_0603]  (value not drawn)
D16  LED_0603  [LED_0603]  (value not drawn)
D17  LED_0603  [LED_0603]  (value not drawn)
D18  LED_0603  [LED_0603]  (value not drawn)
D19  LED_0603  [LED_0603]  (value not drawn)
D24  LED_0603  [LED_0603]  (value not drawn)
D25  LED_0603  [LED_0603]  (value not drawn)
D26  LED_0603  [LED_0603]  (value not drawn)
D27  LED_0603  [LED_0603]  (value not drawn)
R20  value 240R  [RES_0805]  (hidden comment: RES_0805)
R54  value 240R  [RES_0805]  (hidden comment: RES_0805)
R55  value 240R  [RES_0805]  (hidden comment: RES_0805)
R56  value 240R  [RES_0805]  (hidden comment: RES_0805)
R57  value 240R  [RES_0805]  (hidden comment: RES_0805)
R58  value 240R  [RES_0805]  (hidden comment: RES_0805)
R59  value 240R  [RES_0805]  (hidden comment: RES_0805)
R60  value 240R  [RES_0805]  (hidden comment: RES_0805)
R61  value 240R  [RES_0805]  (hidden comment: RES_0805)
R62  value 240R  [RES_0805]  (hidden comment: RES_0805)
R63  value 240R  [RES_0805]  (hidden comment: RES_0805)
R64  value 240R  [RES_0805]  (hidden comment: RES_0805)
R65  value 240R  [RES_0805]  (hidden comment: RES_0805)
R66  value 240R  [RES_0805]  (hidden comment: RES_0805)
R67  value 240R  [RES_0805]  (hidden comment: RES_0805)
R68  value 240R  [RES_0805]  (hidden comment: RES_0805)
R69  value 240R  [RES_0805]  (hidden comment: RES_0805)
R70  value 240R  [RES_0805]  (hidden comment: RES_0805)
U4  TXS0108EPWR  [TXS0108EPWR]

### Ports
FPGA_3V3_IO0 (bidir), FPGA_3V3_IO1 (bidir), FPGA_3V3_IO2 (bidir), FPGA_3V3_IO3 (bidir), GPIO_LED0 (in), GPIO_LED1 (in), GPIO_LED2 (in), GPIO_LED3 (in), GPIO_LED4 (in), GPIO_LED5 (in), GPIO_LED6 (in), GPIO_LED7 (in), LEDINTA_0 (in), LEDINTA_1 (in), LEDINTA_2 (in), LEDINTA_3 (in), LEDINTA_4 (in), LEDINTB_0 (in), LEDINTB_1 (in), LEDINTB_2 (in), LEDINTB_3 (in), LEDINTB_4 (in), OUT_5V0_IO0 (bidir), OUT_5V0_IO1 (bidir), OUT_5V0_IO2 (bidir), OUT_5V0_IO3 (bidir)

### Nets
+3V3: C57.2 U4.2(VCCA) U4.10(OE)
+5V0: C56.2 U4.19(VCCB)
GND: C56.1 C57.1 D2.2(K) D3.2(K) D4.2(K) D5.2(K) D6.2(K) D7.2(K) D8.2(K) D9.2(K) D10.2(K) D15.2(K) D16.2(K) D17.2(K) D18.2(K) D19.2(K) D24.2(K) D25.2(K) D26.2(K) D27.2(K) U4.11(GND)
FPGA_3V3_IO0: U4.1(A1) ; port FPGA_3V3_IO0
FPGA_3V3_IO1: U4.3(A2) ; port FPGA_3V3_IO1
FPGA_3V3_IO2: U4.4(A3) ; port FPGA_3V3_IO2
FPGA_3V3_IO3: U4.5(A4) ; port FPGA_3V3_IO3
GPIO_LED0: R54.2 ; port GPIO_LED0
GPIO_LED1: R57.2 ; port GPIO_LED1
GPIO_LED2: R60.2 ; port GPIO_LED2
GPIO_LED3: R63.2 ; port GPIO_LED3
GPIO_LED4: R66.2 ; port GPIO_LED4
GPIO_LED5: R69.2 ; port GPIO_LED5
GPIO_LED6: R70.2 ; port GPIO_LED6
GPIO_LED7: R20.2 ; port GPIO_LED7
LEDINTA_0: R55.2 ; port LEDINTA_0
LEDINTA_1: R58.2 ; port LEDINTA_1
LEDINTA_2: R61.2 ; port LEDINTA_2
LEDINTA_3: R64.2 ; port LEDINTA_3
LEDINTA_4: R67.2 ; port LEDINTA_4
LEDINTB_0: R56.2 ; port LEDINTB_0
LEDINTB_1: R59.2 ; port LEDINTB_1
LEDINTB_2: R62.2 ; port LEDINTB_2
LEDINTB_3: R65.2 ; port LEDINTB_3
LEDINTB_4: R68.2 ; port LEDINTB_4
OUT_5V0_IO0: U4.20(B1) ; port OUT_5V0_IO0
OUT_5V0_IO1: U4.18(B2) ; port OUT_5V0_IO1
OUT_5V0_IO2: U4.17(B3) ; port OUT_5V0_IO2
OUT_5V0_IO3: U4.16(B4) ; port OUT_5V0_IO3
NetD2_1: D2.1(A) R54.1
NetD3_1: D3.1(A) R55.1
NetD4_1: D4.1(A) R56.1
NetD5_1: D5.1(A) R57.1
NetD6_1: D6.1(A) R58.1
NetD7_1: D7.1(A) R59.1
NetD8_1: D8.1(A) R60.1
NetD9_1: D9.1(A) R61.1
NetD10_1: D10.1(A) R62.1
NetD15_1: D15.1(A) R67.1
NetD16_1: D16.1(A) R68.1
NetD17_1: D17.1(A) R69.1
NetD18_1: D18.1(A) R70.1
NetD19_1: D19.1(A) R20.1
NetD24_1: D24.1(A) R63.1
NetD25_1: D25.1(A) R64.1
NetD26_1: D26.1(A) R65.1
NetD27_1: D27.1(A) R66.1

Not connected (* = marked no-connect by the designer): U4 6(A5) 7(A6) 8(A7) 9(A8) 12(B8) 13(B7) 14(B6) 15(B5)

### Library data of the parts
U4 = TXS0108EPWR: Supplier 1: Digi-Key; Supplier Part Number 1: 296-21527-1-ND

## Sheet InterfacesA_TRANSCEIVER.SchDoc
size A
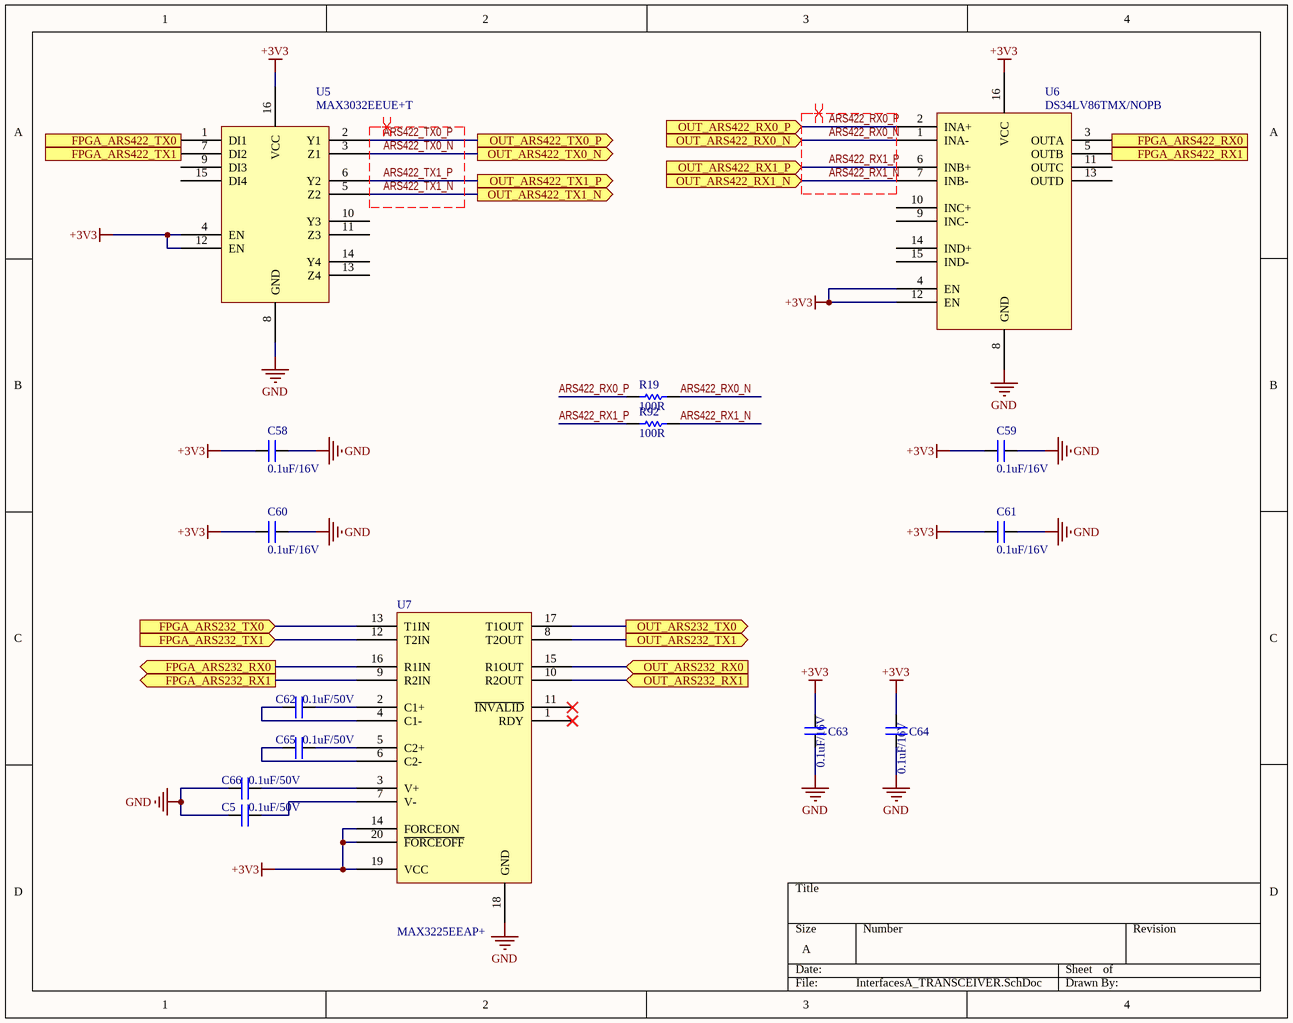
[diagram p5: InterfacesA_TRANSCEIVER.SchDoc]

### Parts
C5  value 0.1uF/50V  [CAP_0805]  (hidden comment: CAP_0805)
C58  value 0.1uF/16V  [CAP_0805]  (hidden comment: CAP_0805)
C59  value 0.1uF/16V  [CAP_0805]  (hidden comment: CAP_0805)
C60  value 0.1uF/16V  [CAP_0805]  (hidden comment: CAP_0805)
C61  value 0.1uF/16V  [CAP_0805]  (hidden comment: CAP_0805)
C62  value 0.1uF/50V  [CAP_0805]  (hidden comment: CAP_0805)
C63  value 0.1uF/16V  [CAP_0805]  (hidden comment: CAP_0805)
C64  value 0.1uF/16V  [CAP_0805]  (hidden comment: CAP_0805)
C65  value 0.1uF/50V  [CAP_0805]  (hidden comment: CAP_0805)
C66  value 0.1uF/50V  [CAP_0805]  (hidden comment: CAP_0805)
R19  value 100R  [RES_0805]  (hidden comment: RES_0805)
R92  value 100R  [RES_0805]  (hidden comment: RES_0805)
U5  MAX3032EEUE+T  [MAX3032EEUE+T]
U6  DS34LV86TMX/NOPB  [DS34LV86TMX/NOPB]
U7  MAX3225EEAP+  [MAX3225EEAP+]

### Ports
FPGA_ARS232_RX0 (out), FPGA_ARS232_RX1 (out), FPGA_ARS232_TX0 (in), FPGA_ARS232_TX1 (in), FPGA_ARS422_RX0 (out), FPGA_ARS422_RX1 (out), FPGA_ARS422_TX0 (in), FPGA_ARS422_TX1 (in), OUT_ARS232_RX0 (in), OUT_ARS232_RX1 (in), OUT_ARS232_TX0 (out), OUT_ARS232_TX1 (out), OUT_ARS422_RX0_N (in), OUT_ARS422_RX0_P (in), OUT_ARS422_RX1_N (in), OUT_ARS422_RX1_P (in), OUT_ARS422_TX0_N (out), OUT_ARS422_TX0_P (out), OUT_ARS422_TX1_N (out), OUT_ARS422_TX1_P (out)

### Nets
+3V3: C58.2 C59.2 C60.2 C61.2 C63.2 C64.2 U5.4(EN) U5.12(EN) U5.16(VCC) U6.4(EN) U6.12(EN) U6.16(VCC) U7.14(FORCEON) U7.19(VCC) U7.20(~{FORCEOFF})
GND: C5.2 C58.1 C59.1 C60.1 C61.1 C63.1 C64.1 C66.2 U5.8(GND) U6.8(GND) U7.18(GND)
ARS422_RX0_N: R19.1 U6.1(INA-) ; port OUT_ARS422_RX0_N
ARS422_RX0_P: R19.2 U6.2(INA+) ; port OUT_ARS422_RX0_P
ARS422_RX1_N: R92.1 U6.7(INB-) ; port OUT_ARS422_RX1_N
ARS422_RX1_P: R92.2 U6.6(INB+) ; port OUT_ARS422_RX1_P
ARS422_TX0_N: U5.3(Z1) ; port OUT_ARS422_TX0_N
ARS422_TX0_P: U5.2(Y1) ; port OUT_ARS422_TX0_P
ARS422_TX1_N: U5.5(Z2) ; port OUT_ARS422_TX1_N
ARS422_TX1_P: U5.6(Y2) ; port OUT_ARS422_TX1_P
FPGA_ARS232_RX0: U7.16(R1IN) ; port FPGA_ARS232_RX0
FPGA_ARS232_RX1: U7.9(R2IN) ; port FPGA_ARS232_RX1
FPGA_ARS232_TX0: U7.13(T1IN) ; port FPGA_ARS232_TX0
FPGA_ARS232_TX1: U7.12(T2IN) ; port FPGA_ARS232_TX1
FPGA_ARS422_RX0: U6.3(OUTA) ; port FPGA_ARS422_RX0
FPGA_ARS422_RX1: U6.5(OUTB) ; port FPGA_ARS422_RX1
FPGA_ARS422_TX0: U5.1(DI1) ; port FPGA_ARS422_TX0
FPGA_ARS422_TX1: U5.7(DI2) ; port FPGA_ARS422_TX1
OUT_ARS232_RX0: U7.15(R1OUT) ; port OUT_ARS232_RX0
OUT_ARS232_RX1: U7.10(R2OUT) ; port OUT_ARS232_RX1
OUT_ARS232_TX0: U7.17(T1OUT) ; port OUT_ARS232_TX0
OUT_ARS232_TX1: U7.8(T2OUT) ; port OUT_ARS232_TX1
NetC5_1: C5.1 U7.7(V-)
NetC62_1: C62.1 U7.2(C1+)
NetC62_2: C62.2 U7.4(C1-)
NetC65_1: C65.1 U7.5(C2+)
NetC65_2: C65.2 U7.6(C2-)
NetC66_1: C66.1 U7.3(V+)

Not connected (* = marked no-connect by the designer): U5 9(DI3) 10(Y3) 11(Z3) 13(Z4) 14(Y4) 15(DI4); U6 9(INC-) 10(INC+) 11(OUTC) 13(OUTD) 14(IND+) 15(IND-); U7 1(RDY)* 11(~{INVALID})*

### Layout directives
differential pair: ARS422_RX0_N, ARS422_RX0_P, ARS422_RX1_N, ARS422_RX1_P, ARS422_TX0_N, ARS422_TX0_P, ARS422_TX1_N, ARS422_TX1_P

### Library data of the parts
C5 C58-C66 = CAP_0603
U5 = MAX3032EEUE+T: Supplier 1: Digi-Key; Supplier Part Number 1: 1016-1522-5-ND
U6 = DS34LV86TMX/NOPB: Supplier 1: Digi-Key; Supplier Part Number 1: 296-13065-1-ND
U7 = MAX3225EEAP+: Supplier 1: Digi-Key; Supplier Part Number 1: MAX3225EEAP+-ND

## Sheet InterfacesA_USBFTDI.SchDoc
size A4
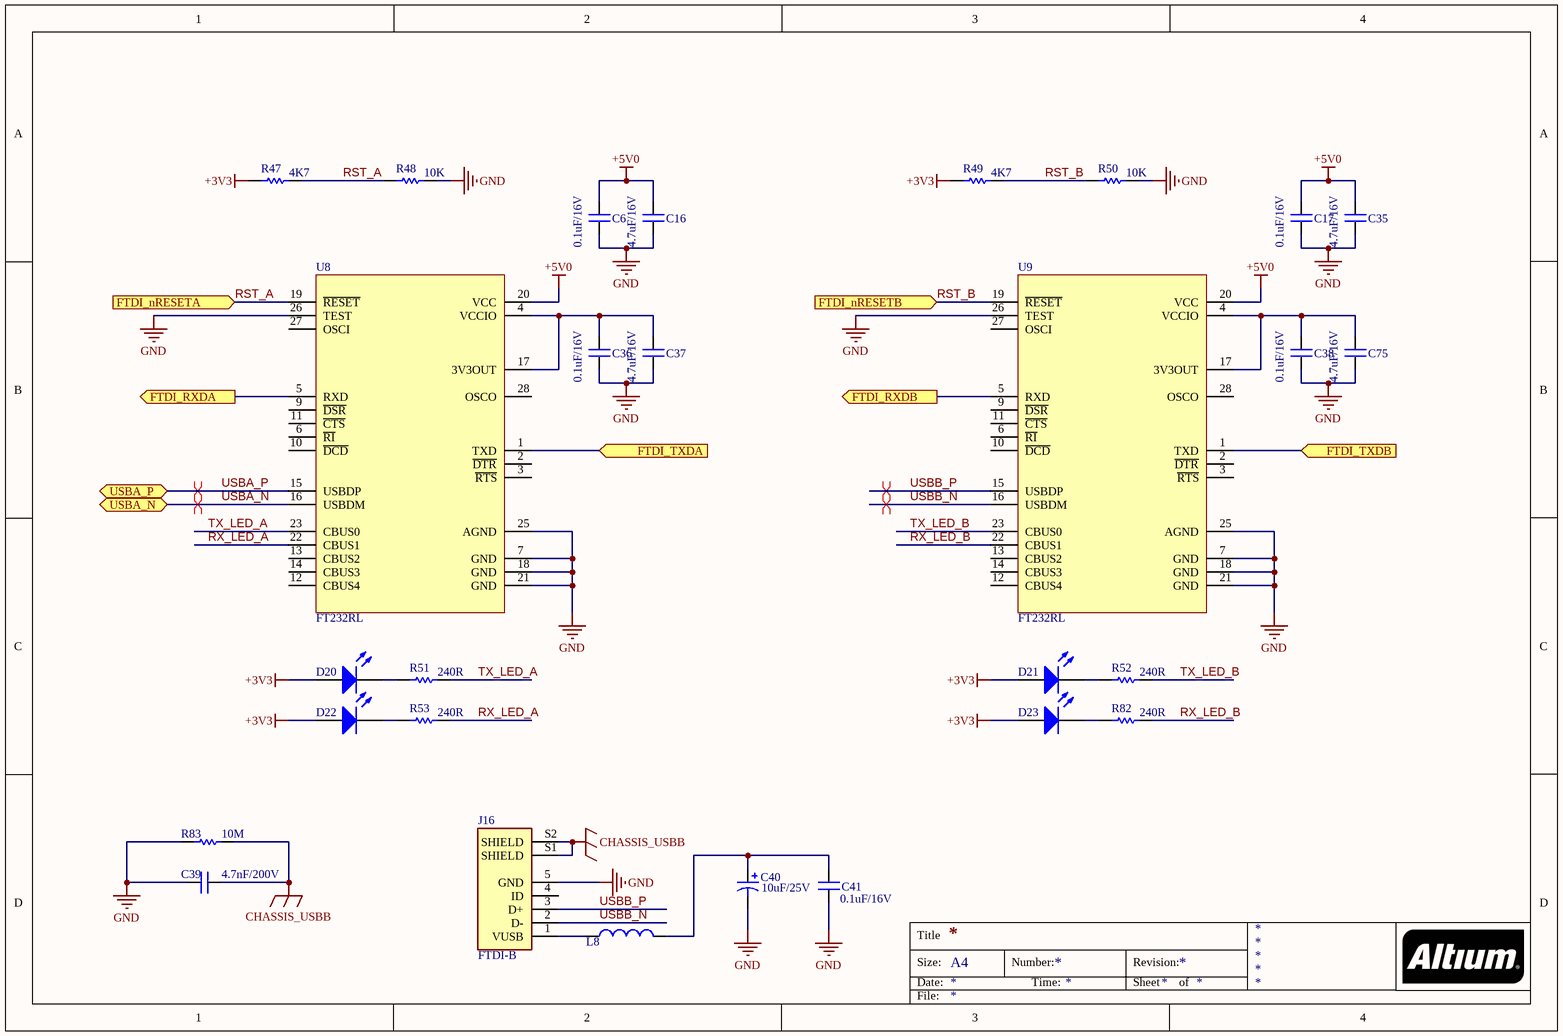
[diagram p6: InterfacesA_USBFTDI.SchDoc]

### Parts
C6  value 0.1uF/16V  [CAP_0805]  (hidden comment: CAP_0805)
C16  value 4.7uF/16V  [CAP_0805]  (hidden comment: CAP_0805)
C17  value 0.1uF/16V  [CAP_0805]  (hidden comment: CAP_0805)
C35  value 4.7uF/16V  [CAP_0805]  (hidden comment: CAP_0805)
C36  value 0.1uF/16V  [CAP_0805]  (hidden comment: CAP_0805)
C37  value 4.7uF/16V  [CAP_0805]  (hidden comment: CAP_0805)
C38  value 0.1uF/16V  [CAP_0805]  (hidden comment: CAP_0805)
C39  value 4.7nF/200V  [CAP_0805]  (hidden comment: CAP_0805)
C40  value 10uF/25V  [CASE-C]  (hidden comment: CASE-C)
C41  value 0.1uF/16V  [CAP_0805]  (hidden comment: CAP_0805)
C75  value 4.7uF/16V  [CAP_0805]  (hidden comment: CAP_0805)
D20  LED_0603  [LED_0603]  (value not drawn)
D21  LED_0603  [LED_0603]  (value not drawn)
D22  LED_0603  [LED_0603]  (value not drawn)
D23  LED_0603  [LED_0603]  (value not drawn)
J16  FTDI-B  [UX60-MB-5S8]
L8  IND_0805  [IND_0805]  (value not drawn)
R47  value 4K7  [RES_0805]  (hidden comment: RES_0805)
R48  value 10K  [RES_0805]  (hidden comment: RES_0805)
R49  value 4K7  [RES_0805]  (hidden comment: RES_0805)
R50  value 10K  [RES_0805]  (hidden comment: RES_0805)
R51  value 240R  [RES_0805]  (hidden comment: RES_0805)
R52  value 240R  [RES_0805]  (hidden comment: RES_0805)
R53  value 240R  [RES_0805]  (hidden comment: RES_0805)
R82  value 240R  [RES_0805]  (hidden comment: RES_0805)
R83  value 10M  [RES_0805]  (hidden comment: RES_0805)
U8  FT232RL  [FT232RL]
U9  FT232RL  [FT232RL]

### Ports
FTDI_nRESETA (in), FTDI_nRESETB (in), FTDI_RXDA (out), FTDI_RXDB (out), FTDI_TXDA (in), FTDI_TXDB (in), USBA_N (bidir), USBA_P (bidir)

### Nets
+3V3: D20.1(A) D21.1(A) D22.1(A) D23.1(A) R47.1 R49.1
+5V0: C6.1 C16.1 C17.1 C35.1 U8.20(VCC) U9.20(VCC)
CHASSIS_USBB: C39.1 J16.S1(SHIELD) J16.S2(SHIELD) R83.1
GND: C6.2 C16.2 C17.2 C35.2 C36.2 C37.2 C38.2 C39.2 C40.K C41.1 C75.2 J16.5(GND) R48.2 R50.2 R83.2 U8.7(GND) U8.18(GND) U8.21(GND) U8.25(AGND) U8.26(TEST) U9.7(GND) U9.18(GND) U9.21(GND) U9.25(AGND) U9.26(TEST)
FTDI_RXDA: U8.5(RXD) ; port FTDI_RXDA
FTDI_RXDB: U9.5(RXD) ; port FTDI_RXDB
FTDI_TXDA: U8.1(TXD) ; port FTDI_TXDA
FTDI_TXDB: U9.1(TXD) ; port FTDI_TXDB
RST_A: R47.2 R48.1 U8.19(~{RESET}) ; port FTDI_nRESETA
RST_B: R49.2 R50.1 U9.19(~{RESET}) ; port FTDI_nRESETB
RX_LED_A: R53.2 U8.22(CBUS1)
RX_LED_B: R82.2 U9.22(CBUS1)
TX_LED_A: R51.2 U8.23(CBUS0)
TX_LED_B: R52.2 U9.23(CBUS0)
USBA_N: U8.16(USBDM) ; port USBA_N
USBA_P: U8.15(USBDP) ; port USBA_P
USBB_N: J16.2(D-) U9.16(USBDM)
USBB_P: J16.3(D+) U9.15(USBDP)
NetC36_1: C36.1 C37.1 U8.4(VCCIO) U8.17(3V3OUT)
NetC38_1: C38.1 C75.1 U9.4(VCCIO) U9.17(3V3OUT)
NetC40_A: C40.A C41.2 L8.2
NetD20_2: D20.2(K) R51.1
NetD21_2: D21.2(K) R52.1
NetD22_2: D22.2(K) R53.1
NetD23_2: D23.2(K) R82.1
NetJ16_1: J16.1(VUSB) L8.1

Not connected (* = marked no-connect by the designer): J16 4(ID); U8 2(~{DTR}) 3(~{RTS}) 6(~{RI}) 9(~{DSR}) 10(~{DCD}) 11(~{CTS}) 12(CBUS4) 13(CBUS2) 14(CBUS3) 27(OSCI) 28(OSCO); U9 2(~{DTR}) 3(~{RTS}) 6(~{RI}) 9(~{DSR}) 10(~{DCD}) 11(~{CTS}) 12(CBUS4) 13(CBUS2) 14(CBUS3) 27(OSCI) 28(OSCO)

### Layout directives
differential pair: USBA_N, USBA_P, USBB_N, USBB_P

### Notes on the sheet
- Title
- Size:
- Date:
- A4
- Number:
- Time:
- Revision:
- Sheet
- of
- File:

### Library data of the parts
C6 C16 C17 C35-C38 C75 = CAP_0603
J16 = UX60-MB-5S8: USB MINI TYPE B
U8 U9 = FT232RL: USB Bridge, USB to UART USB 2.0 UART Interface 28-SSOP; MP: FT232RL-REEL; MF: FTDI,; Digi-Key_Purchase_URL: https://www.digikey.com/product-detail/en/ftdi-future-technology-devices-international-ltd/FT232RL-REEL/768-1007-1-ND/1836402?utm_source=snapeda&utm_medium=aggregator&utm_campaign=symbol; Digi-Key_Part_Number: 768-1007-1-ND; Package: SSOP-28 FTDI; Value: *; SnapEDA_Link: https://www.snapeda.com/parts/FT232RL-REEL/FTDI%2C%20Future%20Technology%20Devices%20International%20Ltd/view-part/45427/?ref=snap

## Sheet InterfacesA_Xbee_Transceiver.SchDoc
size A
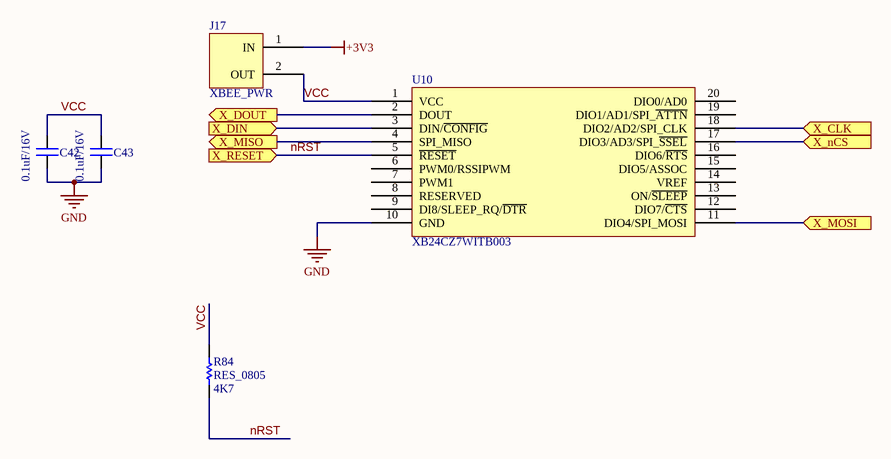
[diagram p7: InterfacesA_Xbee_Transceiver.SchDoc]

### Parts
C42  value 0.1uF/16V  [CAP_0805]  (hidden comment: CAP_0805)
C43  value 0.1uF/16V  [CAP_0805]  (hidden comment: CAP_0805)
J17  XBEE_PWR  [JUMPER 2 PIN]
R84  RES_0805  value 4K7  [RES_0805]
U10  XB24CZ7WITB003  [XB24CZ7WITB003]

### Ports
X_CLK (in), X_DIN (in), X_DOUT (out), X_MISO (out), X_MOSI (in), X_nCS (in), X_RESET (in)

### Nets
+3V3: J17.1(IN)
GND: C42.2 C43.2 U10.10(GND)
nRST: R84.1 U10.5(~{RESET}) ; port X_RESET
VCC: C42.1 C43.1 J17.2(OUT) R84.2 U10.1(VCC)
X_CLK: U10.18(DIO2/AD2/SPI_CLK) ; port X_CLK
X_DIN: U10.3(DIN/~{CONFIG}) ; port X_DIN
X_DOUT: U10.2(DOUT) ; port X_DOUT
X_MISO: U10.4(SPI_MISO) ; port X_MISO
X_MOSI: U10.11(DIO4/SPI_MOSI) ; port X_MOSI
X_nCS: U10.17(DIO3/AD3/SPI_~{SSEL}) ; port X_nCS

Not connected (* = marked no-connect by the designer): U10 6(PWM0/RSSIPWM) 7(PWM1) 8(RESERVED) 9(DI8/SLEEP_RQ/~{DTR}) 12(DIO7/~{CTS}) 13(ON/~{SLEEP}) 14(VREF) 15(DIO5/ASSOC) 16(DIO6/~{RTS}) 19(DIO1/AD1/SPI_~{ATTN}) 20(DIO0/AD0)

### Library data of the parts
C42 C43 = CAP_0603
J17 = JUMPER 2 PIN
U10 = XB24CZ7WITB003: XBEE MODULE

## Sheet InterfacesA_CONNECTORS.SchDoc
size A
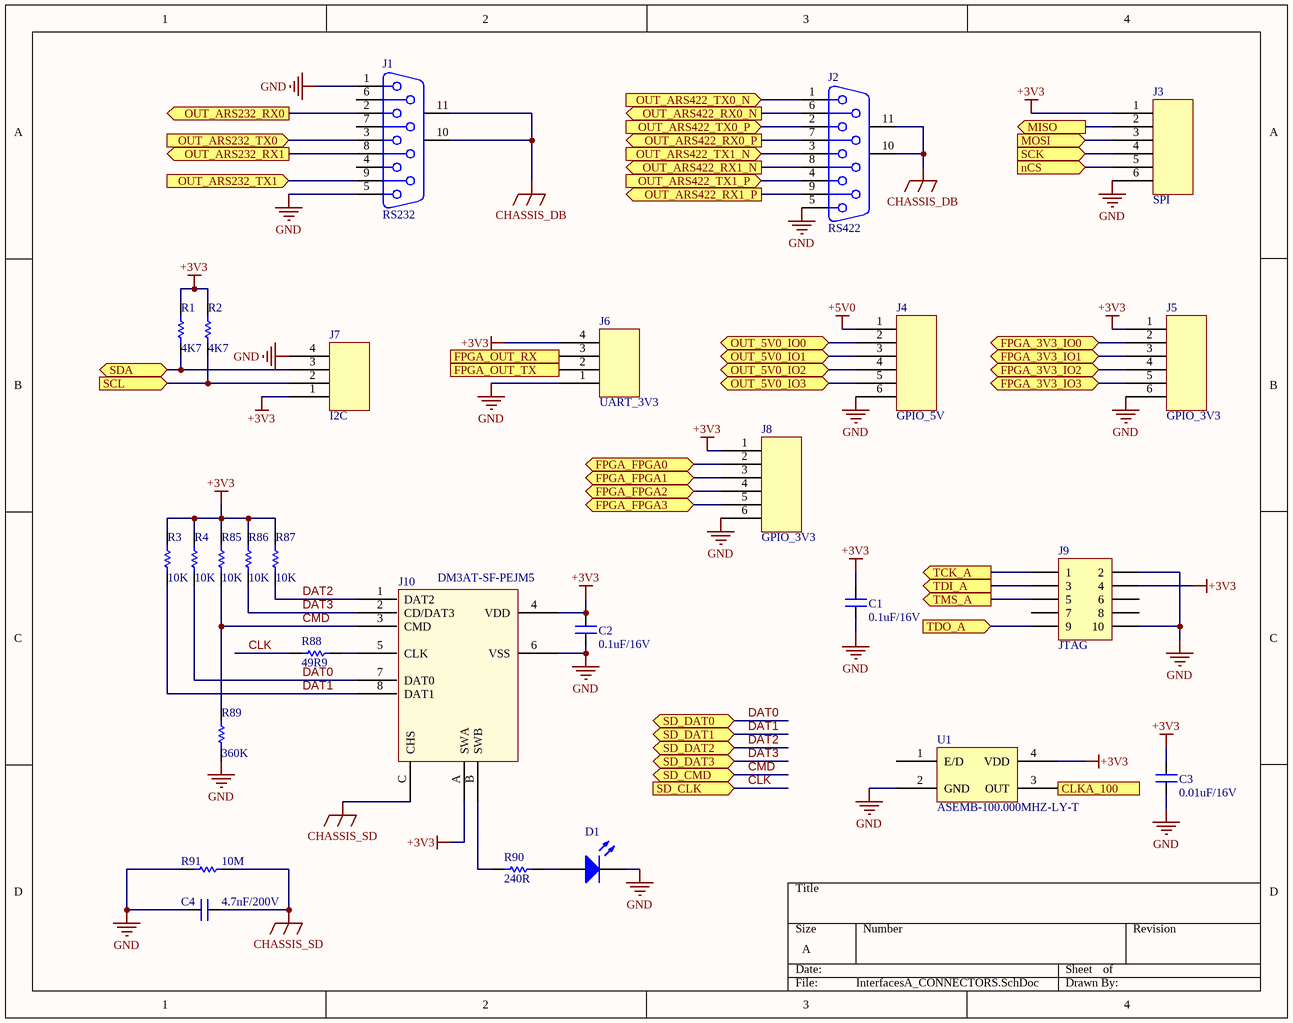
[diagram p8: InterfacesA_CONNECTORS.SchDoc]

### Parts
C1  value 0.1uF/16V  [CAP_0805]  (hidden comment: CAP_0805)
C2  value 0.1uF/16V  [CAP_0805]  (hidden comment: CAP_0805)
C3  value 0.01uF/16V  [CAP_0805]  (hidden comment: CAP_0805)
C4  value 4.7nF/200V  [CAP_0805]  (hidden comment: CAP_0805)
D1  LED_0603  [LED_0603]  (value not drawn)
J1  RS232  [D09S33E4GV00LF]
J2  RS422  [D09S33E4GV00LF]
J3  SPI  [HEADER_6]
J4  GPIO_5V  [HEADER_6]
J5  GPIO_3V3  [HEADER_6]
J6  UART_3V3  [HEADER_4]
J7  I2C  [HEADER_4]
J8  GPIO_3V3  [HEADER_6]
J9  JTAG  [HEADER 5x2]
J10  DM3AT-SF-PEJM5  [DM3AT-SF-PEJM5]
R1  value 4K7  [RES_0805]  (hidden comment: RES_0805)
R2  value 4K7  [RES_0805]  (hidden comment: RES_0805)
R3  value 10K  [RES_0805]  (hidden comment: RES_0805)
R4  value 10K  [RES_0805]  (hidden comment: RES_0805)
R85  value 10K  [RES_0805]  (hidden comment: RES_0805)
R86  value 10K  [RES_0805]  (hidden comment: RES_0805)
R87  value 10K  [RES_0805]  (hidden comment: RES_0805)
R88  value 49R9  [RES_0805]  (hidden comment: RES_0805)
R89  value 360K  [RES_0805]  (hidden comment: RES_0805)
R90  value 240R  [RES_0805]  (hidden comment: RES_0805)
R91  value 10M  [RES_0805]  (hidden comment: RES_0805)
U1  ASEMB-100.000MHZ-LY-T  [ASEMB-100.000MHZ-LY-T]

### Ports
CLKA_100 (out), FPGA_3V3_IO0 (bidir), FPGA_3V3_IO1 (bidir), FPGA_3V3_IO2 (bidir), FPGA_3V3_IO3 (bidir), FPGA_FPGA0 (bidir), FPGA_FPGA1 (bidir), FPGA_FPGA2 (bidir), FPGA_FPGA3 (bidir), FPGA_OUT_RX (out), FPGA_OUT_TX (in), MISO (out), MOSI (in), nCS (in), OUT_5V0_IO0 (bidir), OUT_5V0_IO1 (bidir), OUT_5V0_IO2 (bidir), OUT_5V0_IO3 (bidir), OUT_ARS232_RX0 (out), OUT_ARS232_RX1 (out), OUT_ARS232_TX0 (in), OUT_ARS232_TX1 (in), OUT_ARS422_RX0_N (out), OUT_ARS422_RX0_P (out), OUT_ARS422_RX1_N (out), OUT_ARS422_RX1_P (out), OUT_ARS422_TX0_N (in), OUT_ARS422_TX0_P (in), OUT_ARS422_TX1_N (in), OUT_ARS422_TX1_P (in), SCK (in), SCL (in), SD_CLK (in), SD_CMD (bidir), SD_DAT0 (bidir), SD_DAT1 (bidir), SD_DAT2 (bidir), SD_DAT3 (bidir), SDA (bidir), TCK_A (out), TDI_A (out), TDO_A (in), TMS_A (out)

### Nets
+3V3: C1.2 C2.2 C3.2 J3.1 J5.1 J6.4 J7.1 J8.1 J9.4 J10.4(VDD) J10.A(SWA) R1.2 R2.2 R3.2 R4.2 R85.2 R86.2 R87.2 U1.4(VDD)
+5V0: J4.1
CHASSIS_DB: J1.10(MH1) J1.11(MH2) J2.10(MH1) J2.11(MH2)
CHASSIS_SD: C4.1 J10.C(CHS) R91.1
GND: C1.1 C2.1 C3.1 C4.2 D1.2(K) J1.1 J1.5 J2.5 J3.6 J4.6 J5.6 J6.1 J7.4 J8.6 J9.2 J9.10 J10.6(VSS) R89.1 R91.2 U1.2(GND)
ARS422_RX0_N: J2.6 ; port OUT_ARS422_RX0_N
ARS422_RX0_P: J2.7 ; port OUT_ARS422_RX0_P
ARS422_RX1_N: J2.8 ; port OUT_ARS422_RX1_N
ARS422_RX1_P: J2.9 ; port OUT_ARS422_RX1_P
ARS422_TX0_N: J2.1 ; port OUT_ARS422_TX0_N
ARS422_TX0_P: J2.2 ; port OUT_ARS422_TX0_P
ARS422_TX1_N: J2.3 ; port OUT_ARS422_TX1_N
ARS422_TX1_P: J2.4 ; port OUT_ARS422_TX1_P
CLK: R88.2 ; port SD_CLK
CLKA_100: U1.3(OUT) ; port CLKA_100
CMD: J10.3(CMD) R85.1 R89.2 ; port SD_CMD
DAT0: J10.7(DAT0) R4.1 ; port SD_DAT0
DAT1: J10.8(DAT1) R3.1 ; port SD_DAT1
DAT2: J10.1(DAT2) R87.1 ; port SD_DAT2
DAT3: J10.2(CD/DAT3) R86.1 ; port SD_DAT3
FPGA_3V3_IO0: J5.2 ; port FPGA_3V3_IO0
FPGA_3V3_IO1: J5.3 ; port FPGA_3V3_IO1
FPGA_3V3_IO2: J5.4 ; port FPGA_3V3_IO2
FPGA_3V3_IO3: J5.5 ; port FPGA_3V3_IO3
FPGA_FPGA0: J8.2 ; port FPGA_FPGA0
FPGA_FPGA1: J8.3 ; port FPGA_FPGA1
FPGA_FPGA2: J8.4 ; port FPGA_FPGA2
FPGA_FPGA3: J8.5 ; port FPGA_FPGA3
FPGA_OUT_RX: J6.3 ; port FPGA_OUT_RX
FPGA_OUT_TX: J6.2 ; port FPGA_OUT_TX
MISO: J3.2 ; port MISO
MOSI: J3.3 ; port MOSI
nCS: J3.5 ; port nCS
OUT_5V0_IO0: J4.2 ; port OUT_5V0_IO0
OUT_5V0_IO1: J4.3 ; port OUT_5V0_IO1
OUT_5V0_IO2: J4.4 ; port OUT_5V0_IO2
OUT_5V0_IO3: J4.5 ; port OUT_5V0_IO3
OUT_ARS232_RX0: J1.2 ; port OUT_ARS232_RX0
OUT_ARS232_RX1: J1.8 ; port OUT_ARS232_RX1
OUT_ARS232_TX0: J1.3 ; port OUT_ARS232_TX0
OUT_ARS232_TX1: J1.9 ; port OUT_ARS232_TX1
SCK: J3.4 ; port SCK
SCL: J7.2 R2.1 ; port SCL
SDA: J7.3 R1.1 ; port SDA
TCK_A: J9.1 ; port TCK_A
TDI_A: J9.3 ; port TDI_A
TDO_A: J9.9 ; port TDO_A
TMS_A: J9.5 ; port TMS_A
NetD1_1: D1.1(A) R90.1
NetJ10_5: J10.5(CLK) R88.1
NetJ10_B: J10.B(SWB) R90.2

Not connected (* = marked no-connect by the designer): J1 4 6 7; J9 6 7 8; U1 1(E/D)

### Library data of the parts
J1 J2 = D09S33E4GV00LF: Supplier 1: Digi-Key; Supplier Part Number 1: 609-5184-ND
J3-J5 J8 = HEADER_6
J6 J7 = HEADER_4
J9 = Header 5X2: Header, 5-Pin, Dual row; LatestRevisionDate: 17-Jul-2002; LatestRevisionNote: Re-released for DXP Platform.; Publisher: Altium Limited
J10 = DM3AT-SF-PEJM5: CONN SM MicroSD; Supplier 1: Digi-Key; Supplier Part Number 1: HR1964CT-ND
U1 = ASEMB-100.000MHZ-LY-T: Supplier 1: Digi-Key; Supplier Part Number 1: 535-11083-1-ND

## Nets that join several sheets
+1V2: Power (R71.1), InterfacesA_RGMII_Ethernet (L2.1 L4.1 Q1.3)
+2V5: Power (R73.1 R77.1), InterfacesA_RGMII_Ethernet (5 pins)
+3V3: Power (9 pins), InterfacesA_FPGA (41 pins), InterfacesA_Decoupling (26 pins), InterfacesA_RGMII_Ethernet (14 pins), InterfacesA_SWITCH_LEDS (C57.2 U4.2 U4.10), InterfacesA_TRANSCEIVER (15 pins), InterfacesA_USBFTDI (6 pins), InterfacesA_Xbee_Transceiver (J17.1), InterfacesA_CONNECTORS (19 pins)
+5V0: Power (6 pins), InterfacesA_SWITCH_LEDS (C56.2 U4.19), InterfacesA_USBFTDI (6 pins), InterfacesA_CONNECTORS (J4.1)
GND: Power (36 pins), InterfacesA_FPGA (14 pins), InterfacesA_Decoupling (26 pins), InterfacesA_RGMII_Ethernet (36 pins), InterfacesA_SWITCH_LEDS (21 pins), InterfacesA_TRANSCEIVER (11 pins), InterfacesA_USBFTDI (25 pins), InterfacesA_Xbee_Transceiver (C42.2 C43.2 U10.10), InterfacesA_CONNECTORS (20 pins)
ARS422_RX0_N: InterfacesA_TRANSCEIVER (R19.1 U6.1), InterfacesA_CONNECTORS (J2.6)
ARS422_RX0_P: InterfacesA_TRANSCEIVER (R19.2 U6.2), InterfacesA_CONNECTORS (J2.7)
ARS422_RX1_N: InterfacesA_TRANSCEIVER (R92.1 U6.7), InterfacesA_CONNECTORS (J2.8)
ARS422_RX1_P: InterfacesA_TRANSCEIVER (R92.2 U6.6), InterfacesA_CONNECTORS (J2.9)
ARS422_TX0_N: InterfacesA_TRANSCEIVER (U5.3), InterfacesA_CONNECTORS (J2.1)
ARS422_TX0_P: InterfacesA_TRANSCEIVER (U5.2), InterfacesA_CONNECTORS (J2.2)
ARS422_TX1_N: InterfacesA_TRANSCEIVER (U5.5), InterfacesA_CONNECTORS (J2.3)
ARS422_TX1_P: InterfacesA_TRANSCEIVER (U5.6), InterfacesA_CONNECTORS (J2.4)
CLK: InterfacesA_FPGA (U3.58), InterfacesA_CONNECTORS (R88.2)
CLK_ENET_25: InterfacesA_FPGA (U3.88), InterfacesA_RGMII_Ethernet (R11.2 R12.2)
CLKA_100: InterfacesA_FPGA (U3.110), InterfacesA_CONNECTORS (U1.3)
CMD: InterfacesA_FPGA (U3.60), InterfacesA_CONNECTORS (J10.3 R85.1 R89.2)
CNL_MODE: InterfacesA_FPGA (U3.87), InterfacesA_RGMII_Ethernet (R23.1 R24.2 U12.41)
DAT0: InterfacesA_FPGA (U3.55), InterfacesA_CONNECTORS (J10.7 R4.1)
DAT1: InterfacesA_FPGA (U3.53), InterfacesA_CONNECTORS (J10.8 R3.1)
DAT2: InterfacesA_FPGA (U3.62), InterfacesA_CONNECTORS (J10.1 R87.1)
DAT3: InterfacesA_FPGA (U3.61), InterfacesA_CONNECTORS (J10.2 R86.1)
FPGA_3V3_IO0: InterfacesA_FPGA (U3.127), InterfacesA_SWITCH_LEDS (U4.1), InterfacesA_CONNECTORS (J5.2)
FPGA_3V3_IO1: InterfacesA_FPGA (U3.123), InterfacesA_SWITCH_LEDS (U4.3), InterfacesA_CONNECTORS (J5.3)
FPGA_3V3_IO2: InterfacesA_FPGA (U3.120), InterfacesA_SWITCH_LEDS (U4.4), InterfacesA_CONNECTORS (J5.4)
FPGA_3V3_IO3: InterfacesA_FPGA (U3.119), InterfacesA_SWITCH_LEDS (U4.5), InterfacesA_CONNECTORS (J5.5)
FPGA_ARS232_RX0: InterfacesA_FPGA (U3.21), InterfacesA_TRANSCEIVER (U7.16)
FPGA_ARS232_RX1: InterfacesA_FPGA (U3.22), InterfacesA_TRANSCEIVER (U7.9)
FPGA_ARS232_TX0: InterfacesA_FPGA (U3.23), InterfacesA_TRANSCEIVER (U7.13)
FPGA_ARS232_TX1: InterfacesA_FPGA (U3.25), InterfacesA_TRANSCEIVER (U7.12)
FPGA_ARS422_RX0: InterfacesA_FPGA (U3.13), InterfacesA_TRANSCEIVER (U6.3)
FPGA_ARS422_RX1: InterfacesA_FPGA (U3.12), InterfacesA_TRANSCEIVER (U6.5)
FPGA_ARS422_TX0: InterfacesA_FPGA (U3.20), InterfacesA_TRANSCEIVER (U5.1)
FPGA_ARS422_TX1: InterfacesA_FPGA (U3.14), InterfacesA_TRANSCEIVER (U5.7)
FPGA_FPGA0: InterfacesA_FPGA (U3.40), InterfacesA_CONNECTORS (J8.2)
FPGA_FPGA1: InterfacesA_FPGA (U3.41), InterfacesA_CONNECTORS (J8.3)
FPGA_FPGA2: InterfacesA_FPGA (U3.42), InterfacesA_CONNECTORS (J8.4)
FPGA_FPGA3: InterfacesA_FPGA (U3.43), InterfacesA_CONNECTORS (J8.5)
FPGA_OUT_RX: InterfacesA_FPGA (U3.63), InterfacesA_CONNECTORS (J6.3)
FPGA_OUT_TX: InterfacesA_FPGA (U3.64), InterfacesA_CONNECTORS (J6.2)
FTDI_RXDA: InterfacesA_FPGA (U3.27), InterfacesA_USBFTDI (U8.5)
FTDI_RXDB: InterfacesA_FPGA (U3.32), InterfacesA_USBFTDI (U9.5)
FTDI_TXDA: InterfacesA_FPGA (U3.26), InterfacesA_USBFTDI (U8.1)
FTDI_TXDB: InterfacesA_FPGA (U3.30), InterfacesA_USBFTDI (U9.1)
GPIO_LED0: InterfacesA_FPGA (U3.76), InterfacesA_SWITCH_LEDS (R54.2)
GPIO_LED1: InterfacesA_FPGA (U3.77), InterfacesA_SWITCH_LEDS (R57.2)
GPIO_LED2: InterfacesA_FPGA (U3.80), InterfacesA_SWITCH_LEDS (R60.2)
GPIO_LED3: InterfacesA_FPGA (U3.82), InterfacesA_SWITCH_LEDS (R63.2)
GPIO_LED4: InterfacesA_FPGA (U3.83), InterfacesA_SWITCH_LEDS (R66.2)
GPIO_LED5: InterfacesA_FPGA (U3.84), InterfacesA_SWITCH_LEDS (R69.2)
GPIO_LED6: InterfacesA_FPGA (U3.85), InterfacesA_SWITCH_LEDS (R70.2)
GPIO_LED7: InterfacesA_FPGA (U3.86), InterfacesA_SWITCH_LEDS (R20.2)
GTX_CLK: InterfacesA_FPGA (U3.111), InterfacesA_RGMII_Ethernet (R27.1 R28.2 U12.24)
INT_N: InterfacesA_FPGA (U3.90), InterfacesA_RGMII_Ethernet (R13.1 U12.38)
LEDINTA_0: InterfacesA_FPGA (U3.128), InterfacesA_SWITCH_LEDS (R55.2)
LEDINTA_1: InterfacesA_FPGA (U3.131), InterfacesA_SWITCH_LEDS (R58.2)
LEDINTA_2: InterfacesA_FPGA (U3.133), InterfacesA_SWITCH_LEDS (R61.2)
LEDINTA_3: InterfacesA_FPGA (U3.140), InterfacesA_SWITCH_LEDS (R64.2)
LEDINTA_4: InterfacesA_FPGA (U3.141), InterfacesA_SWITCH_LEDS (R67.2)
LEDINTB_0: InterfacesA_FPGA (U3.6), InterfacesA_SWITCH_LEDS (R56.2)
LEDINTB_1: InterfacesA_FPGA (U3.7), InterfacesA_SWITCH_LEDS (R59.2)
LEDINTB_2: InterfacesA_FPGA (U3.8), InterfacesA_SWITCH_LEDS (R62.2)
LEDINTB_3: InterfacesA_FPGA (U3.10), InterfacesA_SWITCH_LEDS (R65.2)
LEDINTB_4: InterfacesA_FPGA (U3.11), InterfacesA_SWITCH_LEDS (R68.2)
MDC: InterfacesA_FPGA (U3.118), InterfacesA_RGMII_Ethernet (R14.1 U12.36)
MDIO: InterfacesA_FPGA (U3.91), InterfacesA_RGMII_Ethernet (R15.1 U12.37)
MISO: InterfacesA_FPGA (U3.70), InterfacesA_CONNECTORS (J3.2)
MOSI: InterfacesA_FPGA (U3.69), InterfacesA_CONNECTORS (J3.3)
nCS: InterfacesA_FPGA (U3.65), InterfacesA_CONNECTORS (J3.5)
nRST: InterfacesA_FPGA (U3.52), InterfacesA_Xbee_Transceiver (R84.1 U10.5)
OUT_5V0_IO0: InterfacesA_SWITCH_LEDS (U4.20), InterfacesA_CONNECTORS (J4.2)
OUT_5V0_IO1: InterfacesA_SWITCH_LEDS (U4.18), InterfacesA_CONNECTORS (J4.3)
OUT_5V0_IO2: InterfacesA_SWITCH_LEDS (U4.17), InterfacesA_CONNECTORS (J4.4)
OUT_5V0_IO3: InterfacesA_SWITCH_LEDS (U4.16), InterfacesA_CONNECTORS (J4.5)
OUT_ARS232_RX0: InterfacesA_TRANSCEIVER (U7.15), InterfacesA_CONNECTORS (J1.2)
OUT_ARS232_RX1: InterfacesA_TRANSCEIVER (U7.10), InterfacesA_CONNECTORS (J1.8)
OUT_ARS232_TX0: InterfacesA_TRANSCEIVER (U7.17), InterfacesA_CONNECTORS (J1.3)
OUT_ARS232_TX1: InterfacesA_TRANSCEIVER (U7.8), InterfacesA_CONNECTORS (J1.9)
RESET_N: InterfacesA_FPGA (U3.89), InterfacesA_RGMII_Ethernet (R16.1 U12.42)
RST_A: InterfacesA_FPGA (U3.28), InterfacesA_USBFTDI (R47.2 R48.1 U8.19)
RST_B: InterfacesA_FPGA (U3.33), InterfacesA_USBFTDI (R49.2 R50.1 U9.19)
RX_CLK: InterfacesA_FPGA (U3.117), InterfacesA_RGMII_Ethernet (R21.1 R22.2 U12.35)
RX_DATA0: InterfacesA_FPGA (U3.93), InterfacesA_RGMII_Ethernet (R29.1 R30.2 U12.32)
RX_DATA1: InterfacesA_FPGA (U3.96), InterfacesA_RGMII_Ethernet (R31.1 R32.2 U12.31)
RX_DATA2: InterfacesA_FPGA (U3.98), InterfacesA_RGMII_Ethernet (R33.1 R34.2 U12.28)
RX_DATA3: InterfacesA_FPGA (U3.99), InterfacesA_RGMII_Ethernet (R35.1 R36.2 U12.27)
RX_DV: InterfacesA_FPGA (U3.92), InterfacesA_RGMII_Ethernet (R25.1 R26.2 U12.33)
SCK: InterfacesA_FPGA (U3.66), InterfacesA_CONNECTORS (J3.4)
SCL: InterfacesA_FPGA (U3.75), InterfacesA_CONNECTORS (J7.2 R2.1)
SDA: InterfacesA_FPGA (U3.74), InterfacesA_CONNECTORS (J7.3 R1.1)
TCK_A: InterfacesA_FPGA (U3.17), InterfacesA_CONNECTORS (J9.1)
TDI_A: InterfacesA_FPGA (U3.18), InterfacesA_CONNECTORS (J9.3)
TDO_A: InterfacesA_FPGA (U3.19), InterfacesA_CONNECTORS (J9.9)
TMS_A: InterfacesA_FPGA (U3.16), InterfacesA_CONNECTORS (J9.5)
TX_DATA0: InterfacesA_FPGA (U3.106), InterfacesA_RGMII_Ethernet (U12.19)
TX_DATA1: InterfacesA_FPGA (U3.105), InterfacesA_RGMII_Ethernet (U12.20)
TX_DATA2: InterfacesA_FPGA (U3.102), InterfacesA_RGMII_Ethernet (U12.21)
TX_DATA3: InterfacesA_FPGA (U3.101), InterfacesA_RGMII_Ethernet (U12.22)
TX_EN: InterfacesA_FPGA (U3.100), InterfacesA_RGMII_Ethernet (U12.25)
USBA_N: Power (J12.2), InterfacesA_USBFTDI (U8.16)
USBA_P: Power (J12.3), InterfacesA_USBFTDI (U8.15)
X_CLK: InterfacesA_FPGA (U3.46), InterfacesA_Xbee_Transceiver (U10.18)
X_DIN: InterfacesA_FPGA (U3.50), InterfacesA_Xbee_Transceiver (U10.3)
X_DOUT: InterfacesA_FPGA (U3.49), InterfacesA_Xbee_Transceiver (U10.2)
X_MISO: InterfacesA_FPGA (U3.51), InterfacesA_Xbee_Transceiver (U10.4)
X_MOSI: InterfacesA_FPGA (U3.38), InterfacesA_Xbee_Transceiver (U10.11)
X_nCS: InterfacesA_FPGA (U3.39), InterfacesA_Xbee_Transceiver (U10.17)